# EasyEDA Pro project ProProject_AstrOnStep_2024-04-22.epro

# Schematic AstrOnStep SCH

## Sheets
1 Base: Create Date: 2024-03-13; Page Name: Base; Project Name: AstrOnStep; Schematic Name: AstrOnStep SCH; Update Date: 2024-04-21; Company: Velizy Astro Club; Drawed: Paul V.; Page Size: A4; Part Number: AstrOnStep-v1.0; Reviewed: Denis G.; Version: V1.0
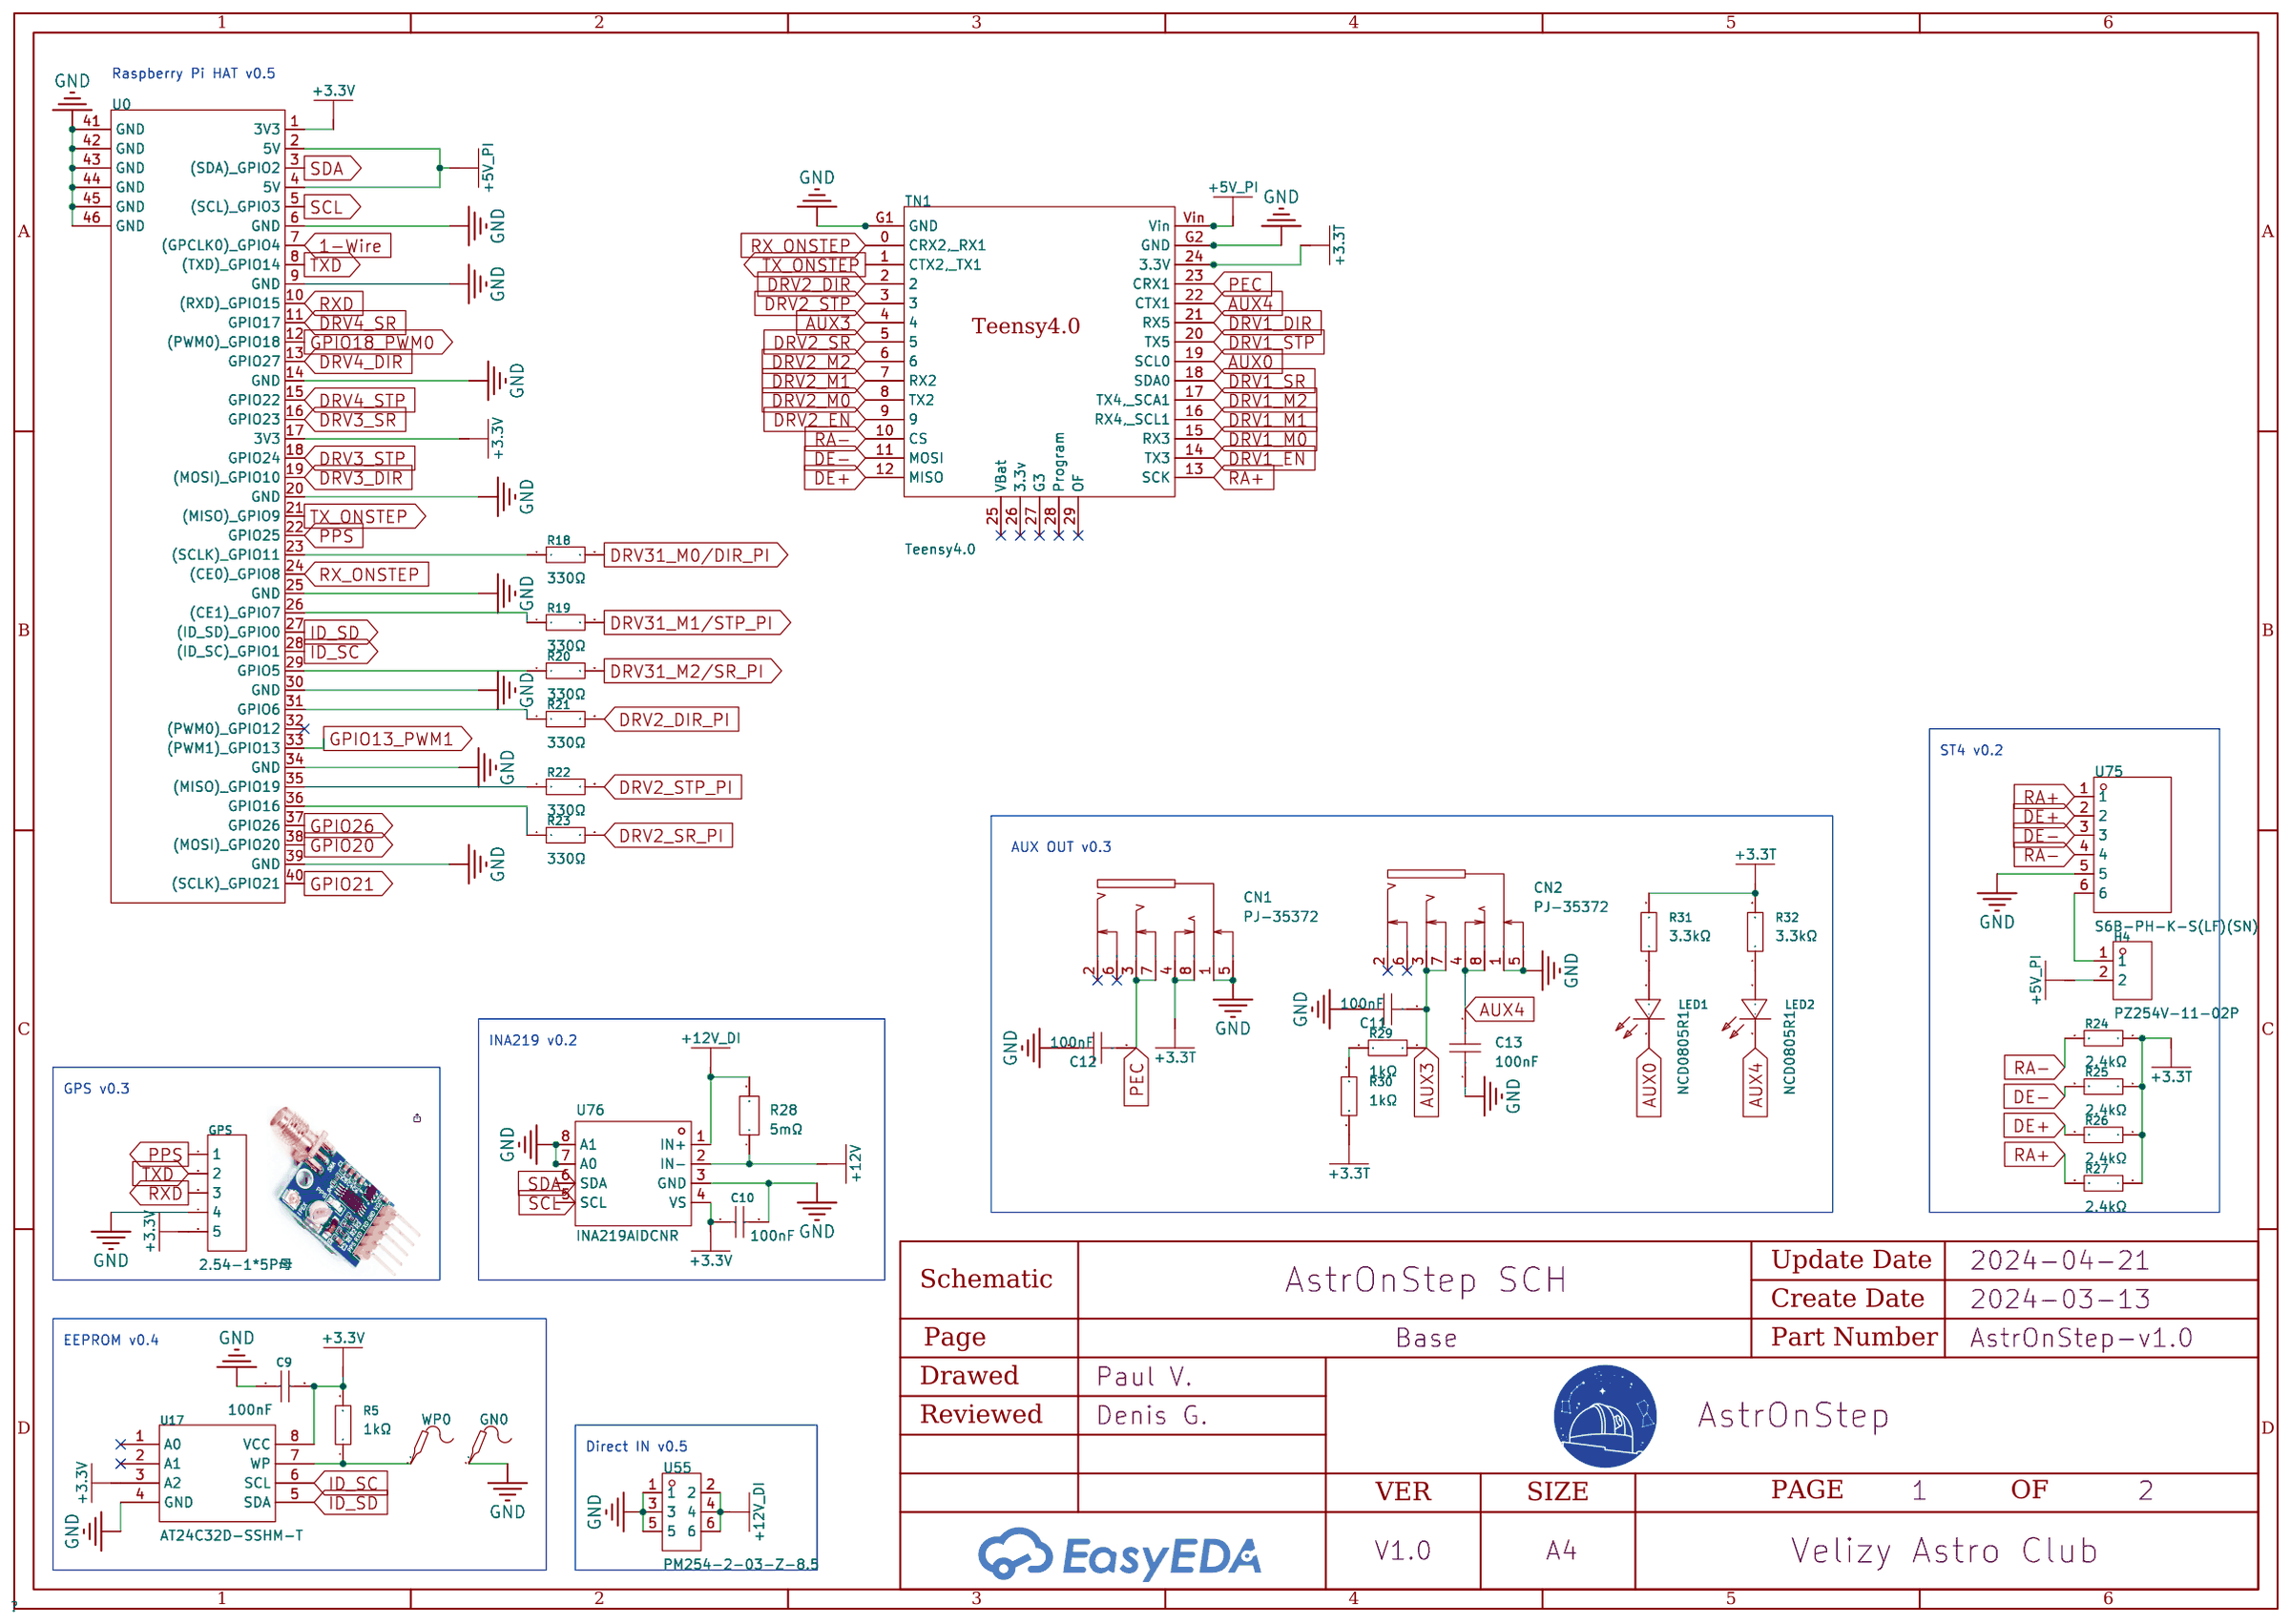
[diagram p0: Base]
2 Motors: Create Date: 2024-04-17; Page Name: Motors.AstrOnStep SCH; Update Date: 2024-04-19; Company: EasyEDA.com; Drawn: EasyEDA; Part Number: JLCPCB-002; Reviewed: EasyEDA; Version: V0.1
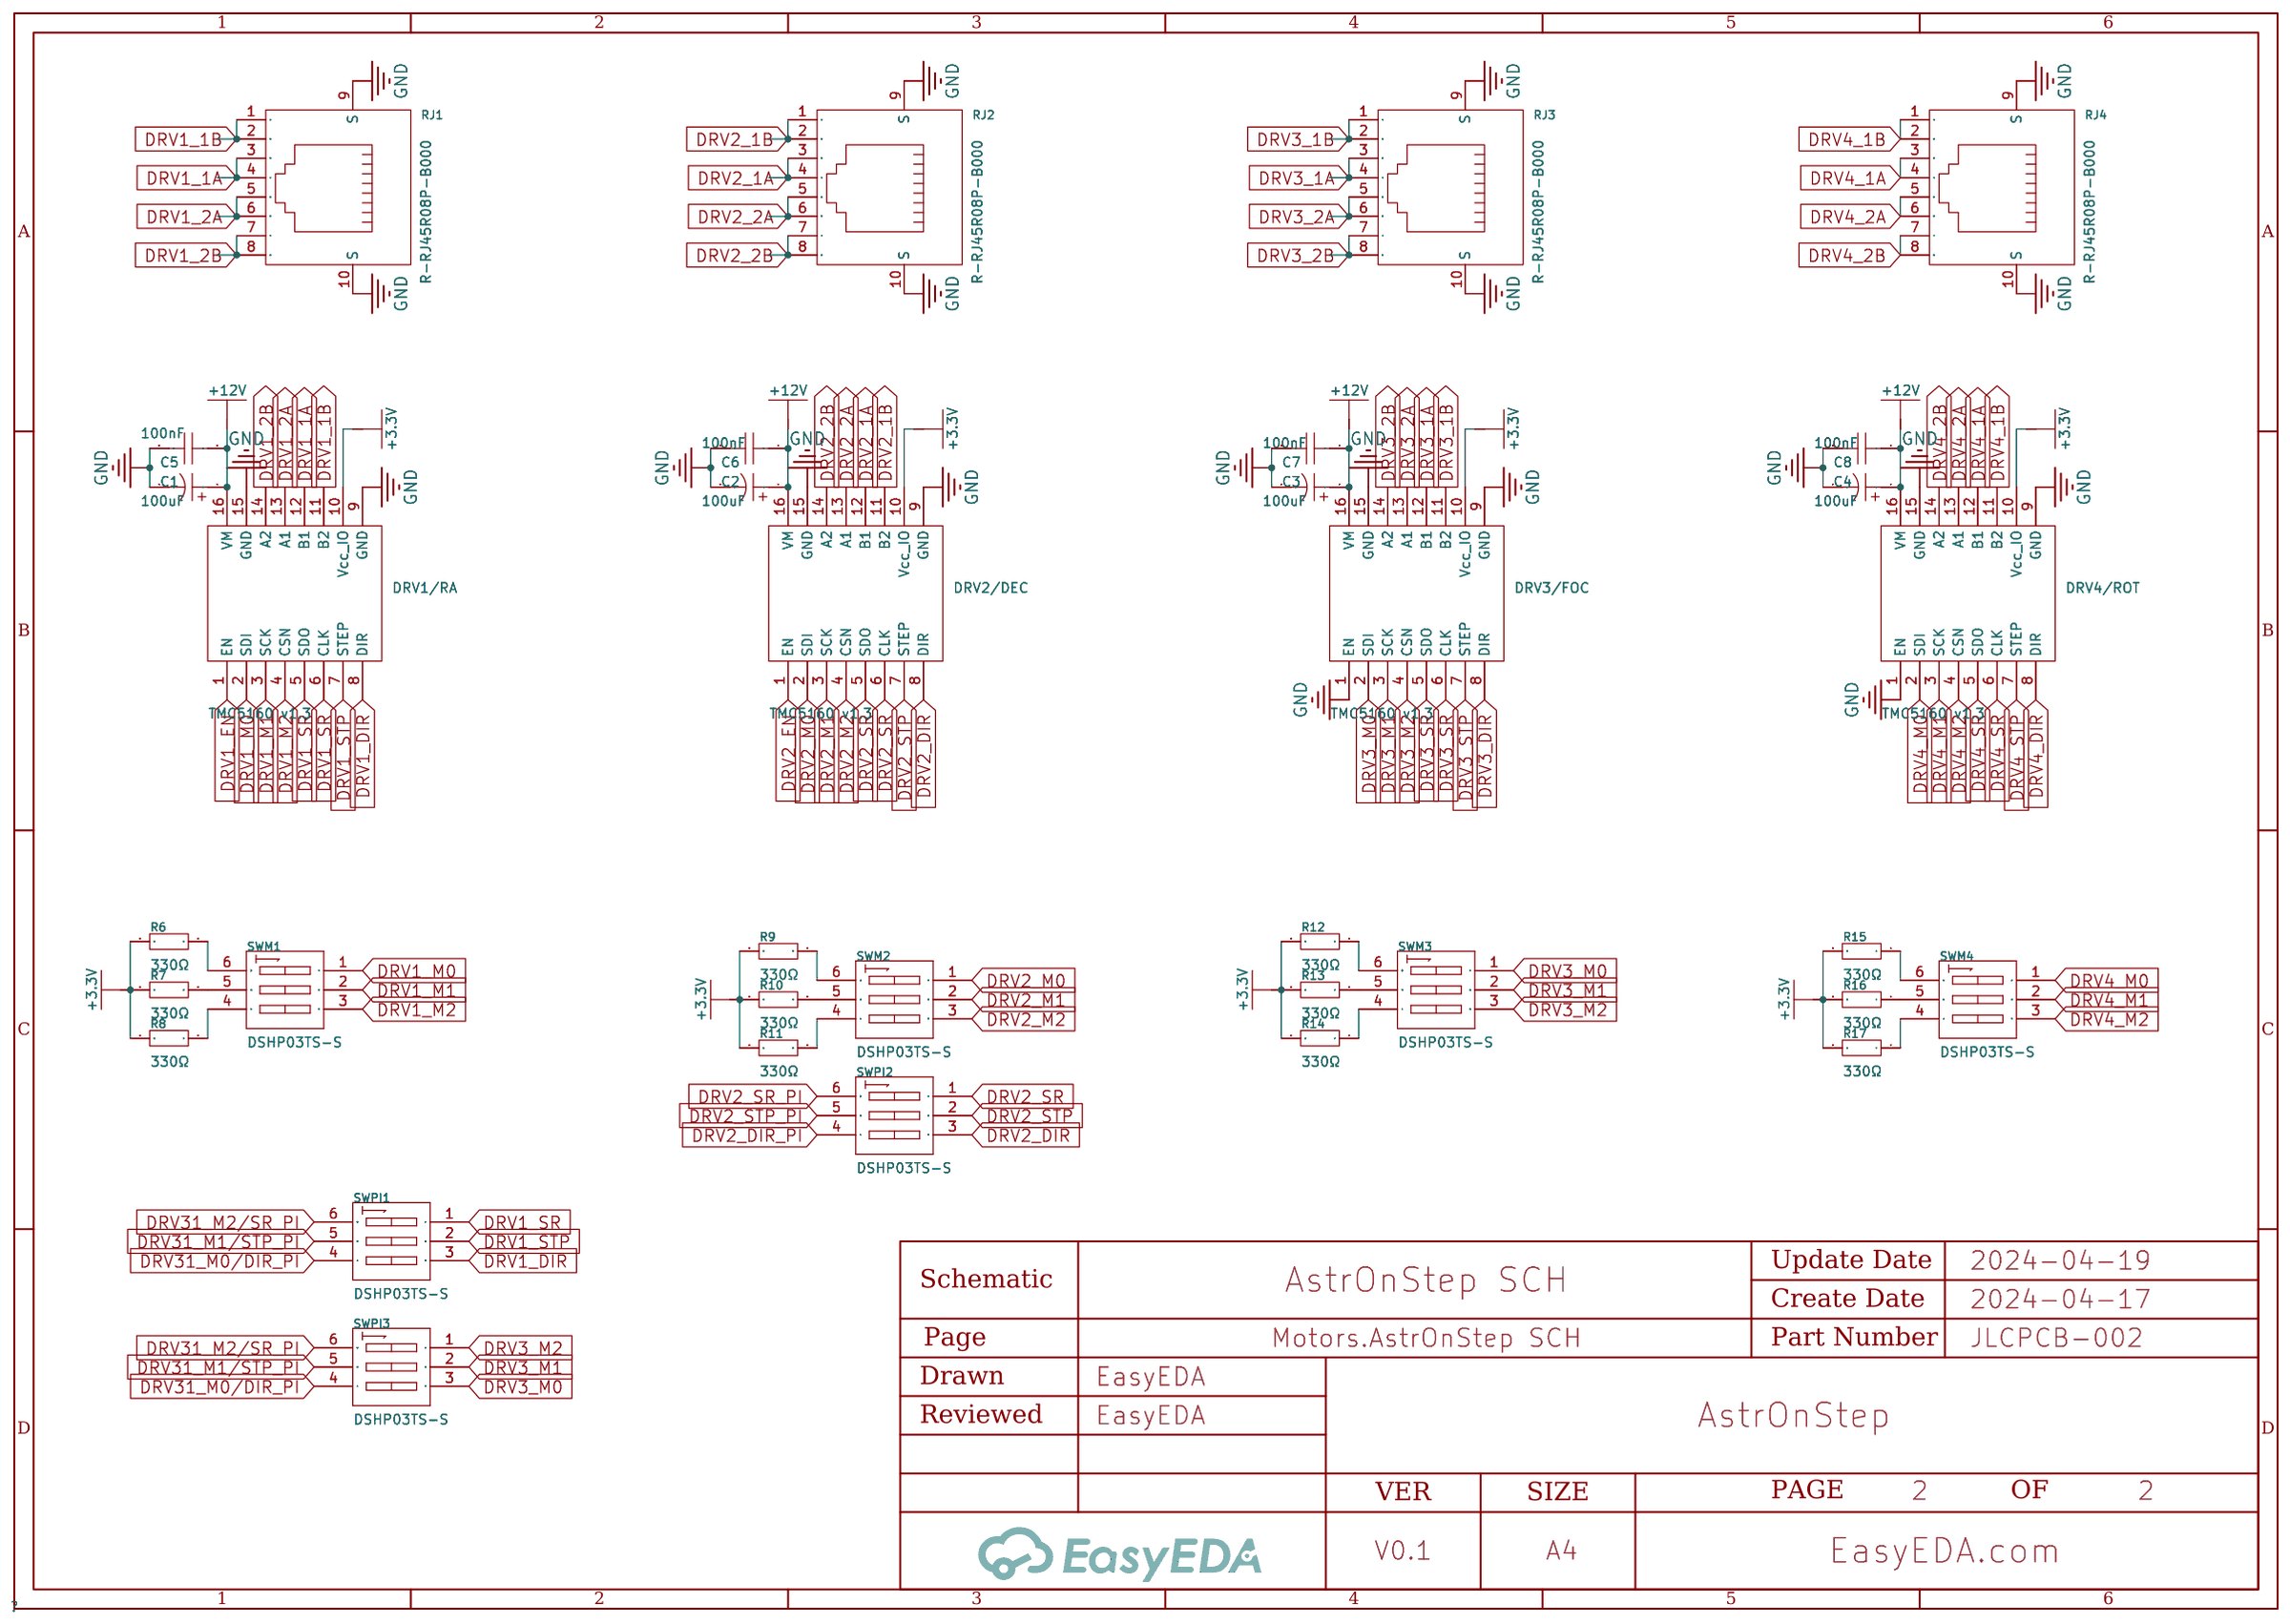
[diagram p1: Motors]

## Parts
sheet Base
C9  100nF  [C0402]
C10  100nF  [C0402]
C11  100nF  [C0603]
C12  100nF  [C0603]
C13  100nF  [C0603]
CN1  PJ-35372  [AUDIO-TH_PJ-35372]
CN2  PJ-35372  [AUDIO-TH_PJ-35372]
GN0  -  [Test-Point-0.5mm]
GPS  2.54-1*5P母  [HDR-TH_5P-P2.54-V-F]  (no BOM)
H4  PZ254V-11-02P  [HDR-TH_2P-P2.54-V-M]  (no BOM)
LED1  NCD0805R1  [LED0805-R-RD]
LED2  NCD0805R1  [LED0805-R-RD]
R5  1kΩ  [R0402]
R18  330Ω  [R0402]
R19  330Ω  [R0402]
R20  330Ω  [R0402]
R21  330Ω  [R0402]
R22  330Ω  [R0402]
R23  330Ω  [R0402]
R24  2.4kΩ  [R0603]
R25  2.4kΩ  [R0603]
R26  2.4kΩ  [R0603]
R27  2.4kΩ  [R0603]
R28  5mΩ  [R2512]
R29  1kΩ  [R0402]
R30  1kΩ  [R0402]
R31  3.3kΩ  [R0402]
R32  3.3kΩ  [R0402]
TN1  Teensy4.0  [TEENSY4.0]  (no BOM)
U0  RASPI HAT FULL  [RASBERRYPI-3-HAT-EXT]  (no BOM)
U17  AT24C32D-SSHM-T  [SOIC-8_L5.0-W4.0-P1.27-LS6.0-BL]
U55  PM254-2-03-Z-8.5  [HDR-TH_6P-P2.54-V-F-R2-C3-S2.54]  (no BOM)
U75  S6B-PH-K-S(LF)(SN)  [CONN-TH_6P-P2.00_S6B-PH-K-S-LF-SN]
U76  INA219AIDCNR  [SOT-23-8_L3.0-W1.7-P0.65-LS2.8-BR]
WP0  -  [Test-Point-0.5mm]
sheet Motors
C1  100uF  [CAP-SMD_BD6.3-L6.6-W6.6-LS7.3-FD]
C2  100uF  [CAP-SMD_BD6.3-L6.6-W6.6-LS7.3-FD]
C3  100uF  [CAP-SMD_BD6.3-L6.6-W6.6-LS7.3-FD]
C4  100uF  [CAP-SMD_BD6.3-L6.6-W6.6-LS7.3-FD]
C5  100nF  [C0603]
C6  100nF  [C0603]
C7  100nF  [C0603]
C8  100nF  [C0603]
DRV1/RA  TMC5160 v1.3  [TMC5160]  (no BOM)
DRV2/DEC  TMC5160 v1.3  [TMC5160]  (no BOM)
DRV3/FOC  TMC5160 v1.3  [TMC5160]  (no BOM)
DRV4/ROT  TMC5160 v1.3  [TMC5160]  (no BOM)
R6  330Ω  [R0402]
R7  330Ω  [R0402]
R8  330Ω  [R0402]
R9  330Ω  [R0402]
R10  330Ω  [R0402]
R11  330Ω  [R0402]
R12  330Ω  [R0402]
R13  330Ω  [R0402]
R14  330Ω  [R0402]
R15  330Ω  [R0402]
R16  330Ω  [R0402]
R17  330Ω  [R0402]
RJ1  R-RJ45R08P-B000  [RJ45-TH_R-RJ45R08P-B000]
RJ2  R-RJ45R08P-B000  [RJ45-TH_R-RJ45R08P-B000]
RJ3  R-RJ45R08P-B000  [RJ45-TH_R-RJ45R08P-B000]
RJ4  R-RJ45R08P-B000  [RJ45-TH_R-RJ45R08P-B000]
SWM1  DSHP03TS-S  [SW-SMD_DSHP03TS-S]
SWM2  DSHP03TS-S  [SW-SMD_DSHP03TS-S]
SWM3  DSHP03TS-S  [SW-SMD_DSHP03TS-S]
SWM4  DSHP03TS-S  [SW-SMD_DSHP03TS-S]
SWPI1  DSHP03TS-S  [SW-SMD_DSHP03TS-S]
SWPI2  DSHP03TS-S  [SW-SMD_DSHP03TS-S]
SWPI3  DSHP03TS-S  [SW-SMD_DSHP03TS-S]

## Library data of the parts
C9 C10 = CL05B104KO5NNNC: Capacitance: Tolerance:±10% Tolerance:±10% Voltage Rated: Temperature Coefficient:; LCSC Part Name: 100nF ±10% 16V; Supplier Part: C1525; Manufacturer: SAMSUNG(三星); Supplier Footprint: 0402; Datasheet: https://atta.szlcsc.com/upload/public/pdf/source/20160218/1457707763339.pdf; Supplier: LCSC; Tolerance: ±10%
C5-C8 C11-C13 = CC0603KRX7R9BB104: Capacitance:Tolerance:±10%Tolerance:±10%VoltageRated:TemperatureCoefficient:; LCSC Part Name: 100nF±10%50V; Supplier Part: C14663; Manufacturer: YAGEO(国巨); Supplier Footprint: 0603; JLCPCB Part Class: BasicPart; Datasheet: https://atta.szlcsc.com/upload/public/pdf/source/20180910/C282072_33301C7F631E79921B82A8DAC6BCC5B3.pdf; Supplier: LCSC; Tolerance: ±10%
CN1 CN2 = PJ-35372: Connector Type:3.5mm耳机座 Current Rating (Max):0.5A Voltage Rating (Max):30V Operating Temperature Range:-20℃~+70℃ Operating Temperature Range:-20℃~+70℃ Welding Temperature (Max):235℃; LCSC Part Name: 3.5mm耳机座 镀金4节; Supplier Part: C397354; Manufacturer: XKB Connectivity(中国星坤); Supplier Footprint: 插件; JLCPCB Part Class: Extended Part; Datasheet: https://atta.szlcsc.com/upload/public/pdf/source/20211011/70AECB394666925CFEDAEC6F68531937.pdf; Supplier: LCSC; Connector Type: 3.5mm耳机座; Current Rating (Max): 0.5A; Voltage Rating (Max): 30V; Operating Temperature Range: -20℃~+70℃; Welding Temperature (Max): 235℃
GN0 WP0 = Test-Point: Test Point 测试点
GPS = 2.54-1*5P母: Number of Rows:Plugin Number of Holes:5P Pitch:2.54mm Holes Structure:1x5P Row Spacing:- Mounting Type:Straight Insulation Height:- Contact Material:- Contact Plating:-; LCSC Part Name: 间距:2.54mm 1x5P 直插; Supplier Part: C50950; Manufacturer: BOOMELE(博穆精密); Supplier Footprint: 插件,P=2.54mm; Datasheet: https://atta.szlcsc.com/upload/public/pdf/source/20210301/C2718488_F4427B881E42CAA8DDB0B1C12B3A522C.pdf; Supplier: LCSC; Number of Rows: Plugin; Number of Holes: 5P; Pitch: 2.54mm; Holes Structure: 1x5P; Mounting Type: Straight
H4 = PZ254V-11-02P: Number of Rows:Plugin Number of Pins:2P Pitch:2.54mm Pin Structure:1x2P Row Spacing:- Mounting Type:Straight Circluar Pins/Square Pins:Square Pins Current Rating (Max):- Voltage Rating (Max):- Length of Mating Pin:6mm Insulation Height:2.5mm Length of End; LCSC Part Name: 2.54mm 1x2P 直插 方针; Supplier Part: C492401; Manufacturer: XFCN(兴飞); Supplier Footprint: 插件,P=2.54mm; JLCPCB Part Class: Extended Part; Datasheet: https://atta.szlcsc.com/upload/public/pdf/source/20200309/C492401_A812433581A9B211A7FFA413ADDFF0E5.pdf; Supplier: LCSC; Number of Rows: Plugin; Number of Pins: 2P; Pitch: 2.54mm; Pin Structure: 1x2P; Mounting Type: Straight; Circluar Pins/Square Pins: Square Pins; Length of Mating Pin: 6mm; Insulation Height: 2.5mm; Length of End Connection Pin: 3mm; Operating Temperature Range: -40℃~+105℃; Color: Black
LED1 LED2 = NCD0805R1_C84256: Emitted Color:Red Diode Configuration:- Lamp Holder Type:- Forward Voltage (VF):1.6V~2.6V Forward Voltage (VF):1.6V~2.6V Forward Current:20mA Power Dissipation:65mW Lens Color:无色透明 Dominant Wavelength:615nm~630nm Dominant Wavelength:615nm~630nm Peak Wavel; LCSC Part Name: 红灯 0805红灯   正贴; Supplier Part: C84256; Manufacturer: 国星光电; Supplier Footprint: 0805; JLCPCB Part Class: Basic Part; Datasheet: https://atta.szlcsc.com/upload/public/pdf/source/20200820/C84256_F0A75A43B3EAD75808600A0514C76B99.pdf; Supplier: LCSC; Emitted Color: Red; Forward Voltage (VF): 1.6V~2.6V; Forward Current: 20mA; Power Dissipation: 65mW; Lens Color: 无色透明; Dominant Wavelength: 615nm~630nm; Luminous Intensity: 67mcd~195mcd; Viewing Angle: 130°; Operating Temperature: -30℃~+85℃
R5 R29 R30 = 0402WGF1001TCE: Resistance:1000Ω Tolerance:±1% Tolerance:±1% Power(Watts): Overload Voltage (Max): Temperature Coefficient:±100ppm/℃ Temperature Coefficient:±100ppm/℃ Type:Thick Film Resistors Operating Temperature Range:-55℃~+155℃ Operating Temperature Range:-55℃~+155℃; LCSC Part Name: 1kΩ ±1% 62.5mW 厚膜电阻; Supplier Part: C11702; Manufacturer: UNI-ROYAL(厚声); Supplier Footprint: 0402; JLCPCB Part Class: Basic Part; Datasheet: https://atta.szlcsc.com/upload/public/pdf/source/20200306/C422600_1E6D84923E4A46A82E41ADD87F860B5C.pdf; Supplier: LCSC; Tolerance: ±1%; Temperature Coefficient: ±100ppm/℃; Type: Thick Film Resistors; Operating Temperature Range: -55℃~+155℃
R6-R23 = 0402WGF3300TCE: Type:Thick Film Resistors Resistance: Tolerance:±1% Tolerance:±1% Power(Watts): Overload Voltage (Max): Temperature Coefficient:±100ppm/℃ Temperature Coefficient:±100ppm/℃ Operating Temperature Range:-55℃~+155℃ Operating Temperature Range:-55℃~+155℃; LCSC Part Name: 330Ω ±1% 62.5mW 厚膜电阻; Supplier Part: C25104; Manufacturer: UNI-ROYAL(厚声); Supplier Footprint: 0402; Datasheet: https://atta.szlcsc.com/upload/public/pdf/source/20200306/C422600_1E6D84923E4A46A82E41ADD87F860B5C.pdf; Supplier: LCSC; Type: Thick Film Resistors; Tolerance: ±1%; Temperature Coefficient: ±100ppm/℃; Operating Temperature Range: -55℃~+155℃
R24-R27 = 0603WAF2401T5E: Type:Thick Film Resistors Resistance:2.4kΩ Tolerance:±1% Tolerance:±1% Power(Watts): Overload Voltage (Max): Temperature Coefficient:±100ppm/℃ Temperature Coefficient:±100ppm/℃ Operating Temperature Range:-55℃~+155℃ Operating Temperature Range:-55℃~+155℃; LCSC Part Name: 2.4kΩ ±1% 100mW 厚膜电阻; Supplier Part: C22940; Manufacturer: UNI-ROYAL(厚声); Supplier Footprint: 0603; Datasheet: https://atta.szlcsc.com/upload/public/pdf/source/20200306/C422600_1E6D84923E4A46A82E41ADD87F860B5C.pdf; Supplier: LCSC; Type: Thick Film Resistors; Tolerance: ±1%; Temperature Coefficient: ±100ppm/℃; Operating Temperature Range: -55℃~+155℃
R28 = PA2512FKF7T0R005E: Type: Resistance: Tolerance:±1% Tolerance:±1% Power(Watts): Temperature Coefficient:±100ppm/℃ Temperature Coefficient:±100ppm/℃ Operating Temperature Range:-55℃~+170℃ Operating Temperature Range:-55℃~+170℃; LCSC Part Name: 5mΩ ±1% 3W; Supplier Part: C728323; Manufacturer: YAGEO(国巨); Supplier Footprint: 2512; Datasheet: https://atta.szlcsc.com/upload/public/pdf/source/20200824/C728323_8414E4B9EE47C66850A19F4536DCF70D.pdf; Supplier: LCSC; Tolerance: ±1%; Temperature Coefficient: ±100ppm/℃; Operating Temperature Range: -55℃~+170℃
R31 R32 = 0402WGF3301TCE: Type:Thick Film Resistors Resistance:3.3kΩ Tolerance:±1% Tolerance:±1% Power(Watts): Overload Voltage (Max): Temperature Coefficient:±100ppm/℃ Temperature Coefficient:±100ppm/℃ Operating Temperature Range:-55℃~+155℃ Operating Temperature Range:-55℃~+155℃; LCSC Part Name: 3.3kΩ ±1% 62.5mW 厚膜电阻; Supplier Part: C25890; Manufacturer: UNI-ROYAL(厚声); Supplier Footprint: 0402; JLCPCB Part Class: Basic Part; Datasheet: https://atta.szlcsc.com/upload/public/pdf/source/20200306/C422600_1E6D84923E4A46A82E41ADD87F860B5C.pdf; Supplier: LCSC; Type: Thick Film Resistors; Tolerance: ±1%; Temperature Coefficient: ±100ppm/℃; Operating Temperature Range: -55℃~+155℃
TN1 = Teensy4.0
U0 = RASPI HAT FULL - NO OUTLINE: Manufacturer Part: RaspberryPi 3
U17 = AT24C32D-SSHM-T: Interface Type:I2C Memory Size:32Kbit Supply Voltage:1.7V~5.5V Supply Voltage:1.7V~5.5V Operating Temperature:-40℃~+85℃ Operating Temperature:-40℃~+85℃; Supplier Part: C60583; Manufacturer: MICROCHIP(美国微芯); Supplier Footprint: SOIC-8; Datasheet: https://atta.szlcsc.com/upload/public/pdf/source/20151012/1457707446205.pdf; Supplier: LCSC; Interface Type: I2C; Memory Size: 32Kbit; Supply Voltage: 1.7V~5.5V; Operating Temperature: -40℃~+85℃
U55 = PM254-2-03-Z-8.5: Holes Structure:2x3P Pitch:2.54mm Row Spacing:2.54mm Circular Hole / Square Hole:Square Holes Mounting Type:Straight Number of Rows:双排 Number of Holes:6P Current Rating (Max):3A Voltage Rating (Max):- Holes Direction:Top Insulation Height:8.5mm Contact Ma; LCSC Part Name: 2x3P 间距:2.54mm 直插; Supplier Part: C2897404; Manufacturer: HCTL(华灿天禄); Supplier Footprint: 插件,P=2.54mm; Datasheet: https://atta.szlcsc.com/upload/public/pdf/source/20230609/3D36CA2C1BFC9FD1C3F709AD9DFEB9C2.pdf; Supplier: LCSC; Holes Structure: 2x3P; Pitch: 2.54mm; Row Spacing: 2.54mm; Circular Hole / Square Hole: Square Holes; Mounting Type: Straight; Number of Rows: 双排; Number of Holes: 6P; Current Rating (Max): 3A; Holes Direction: Top; Insulation Height: 8.5mm; Contact Material: Copper Alloy; Operating Temperature Range: -40℃~+105℃; Soldering Temperature(Max): 260℃@5S
U75 = S6B-PH-K-S(LF)(SN): Pins Structure:1x6P Pitch:2mm Mounting Style:Right-Angle Reference Series:PH Number of Pins:6P Number of Rows:1 Number of PINs Per Row:6 Row Spacing:- Contact Material:Brass; LCSC Part Name: 系列:PH 间距:2mm 1x6P; Supplier Part: C157920; Manufacturer: JST; Supplier Footprint: 弯插,P=2mm; JLCPCB Part Class: Extended Part; Datasheet: https://atta.szlcsc.com/upload/public/pdf/source/20181010/C265101_22107ACC4D8714694FDA2DD97145FA81.pdf; Supplier: LCSC; Pins Structure: 1x6P; Pitch: 2mm; Mounting Style: Right-Angle; Reference Series: PH; Number of Pins: 6P; Number of Rows: 1; Number of PINs Per Row: 6; Contact Material: Brass
U76 = INA219AIDCNR: Supplier Part: C87469; Manufacturer: TI(德州仪器); Supplier Footprint: SOT-23-8; JLCPCB Part Class: Extended Part; Datasheet: https://www.ti.com/cn/lit/gpn/ina219; Supplier: LCSC
C1-C4 = RST100UF25V004: Capacitance: Tolerance:±20% Tolerance:±20% Rated Voltage: Ripple Current:88mA@120Hz Equivalent Series Resistance(ESR):- φD: L: Lifetime @ Temp:2000hrs@105℃ Operating Temperature:-40℃~+105℃ Operating Temperature:-40℃~+105℃; LCSC Part Name: 100uF ±20% 25V; Supplier Part: C4747964; Manufacturer: KNSCHA(科尼盛); Supplier Footprint: SMD,D6.3xL5.4mm; Datasheet: https://atta.szlcsc.com/upload/public/pdf/source/20220722/52F6C209ACF875FF59C64C72CE2329EE.pdf; Supplier: LCSC; Tolerance: ±20%; Ripple Current: 88mA@120Hz; Lifetime @ Temp: 2000hrs@105℃; Operating Temperature: -40℃~+105℃
DRV1/RA DRV2/DEC DRV3/FOC DRV4/ROT = TMC5160 v1.3: Manufacturer: Bigtreetech; Supplier: TRIMAC
RJ1-RJ4 = R-RJ45R08P-B000: Connector Type:RJReceptacle USOC Codes:RJ45 Number of Ports:1 Mounting Style:Right-Angle Shielding:有屏蔽 LED:不带LED Ratings:- Operating Temperature Range:0℃~+70℃ Operating Temperature Range:0℃~+70℃; LCSC Part Name: RJ45 弯插 不带LED; Supplier Part: C386756; Manufacturer: Ckmtw(灿科盟); Supplier Footprint: 插件; Datasheet: https://atta.szlcsc.com/upload/public/pdf/source/20190508/C386756_CEA064C28A6A9ED64075DA45BB64214F.pdf; Supplier: LCSC; Connector Type: RJReceptacle; USOC Codes: RJ45; Number of Ports: 1; Mounting Style: Right-Angle; Shielding: 有屏蔽; LED: 不带LED; Operating Temperature Range: 0℃~+70℃
SWM1-SWM4 SWPI1-SWPI3 = DSHP03TS-S: Type:平拨,凹槽式 Circuit:SPST Number of Positions:3Bit Pin Style:Gull Wing Lead Pitch:1.27mm Current Rating:25mA Voltage Rating:24V Operating Temperature:-20℃~+70℃ Operating Temperature:-20℃~+70℃ Operating Life:3千次 Color:Black; LCSC Part Name: 间距1.27mm 平拨,凹槽式 3位拨码开关; Supplier Part: C319051; Manufacturer: XKB Connectivity(中国星坤); Supplier Footprint: SMD-6P,5.4x5.4mm; Datasheet: https://atta.szlcsc.com/upload/public/pdf/source/20211009/11BE85C99D2C85B0991AF4F9D6EB8BDE.pdf; Supplier: LCSC; Type: 平拨,凹槽式; Circuit: SPST; Number of Positions: 3Bit; Pin Style: Gull Wing; Lead Pitch: 1.27mm; Current Rating: 25mA; Voltage Rating: 24V; Operating Temperature: -20℃~+70℃; Operating Life: 3千次; Color: Black

## Nets
+3.3V: C9.2 C10.1 DRV1/RA.10(Vcc IO) DRV2/DEC.10(Vcc IO) DRV3/FOC.10(Vcc IO) DRV4/ROT.10(Vcc IO) GPS.5 R5.2 R6.2 R7.2 R8.2 R9.2 R10.2 R11.2 R12.2 R13.2 R14.2 R15.2 R16.2 R17.2 U0.1(3V3) U0.17(3V3) U17.3(A2) U17.8(VCC) U76.4(VS)
+5V_PI: H4.2 TN1.Vin U0.2(5V) U0.4(5V)
+12V: C1.1 C2.1 C3.1 C4.1 C5.1 C6.1 C7.1 C8.1 DRV1/RA.16(VM) DRV2/DEC.16(VM) DRV3/FOC.16(VM) DRV4/ROT.16(VM) R28.1 U76.2(IN-)
+12V_DI: R28.2 U55.2 U55.4 U55.6 U76.1(IN+)
GND: C1.2 C2.2 C3.2 C4.2 C5.2 C6.2 C7.2 C8.2 C9.1 C10.2 C11.2 C12.2 C13.1 CN1.1 CN1.5 CN2.1 CN2.5 DRV1/RA.9(GND) DRV1/RA.15(GND) DRV2/DEC.9(GND) DRV2/DEC.15(GND) DRV3/FOC.1(EN) DRV3/FOC.9(GND) DRV3/FOC.15(GND) DRV4/ROT.1(EN) DRV4/ROT.9(GND) DRV4/ROT.15(GND) GN0.1 GPS.4 RJ1.9(S) RJ1.10(S) RJ2.9(S) RJ2.10(S) RJ3.9(S) RJ3.10(S) RJ4.9(S) RJ4.10(S) TN1.G1(GND) TN1.G2(GND) U0.6(GND) U0.9(GND) U0.14(GND) U0.20(GND) U0.25(GND) U0.30(GND) U0.34(GND) U0.39(GND) U0.41(GND) U0.42(GND) U0.43(GND) U0.44(GND) U0.45(GND) U0.46(GND) U17.4(GND) U55.1 U55.3 U55.5 U75.5 U76.3(GND) U76.7(A0) U76.8(A1)
1-Wire: U0.7((GPCLK0) GPIO4)
+3.3T: CN1.4 CN1.8 R24.1 R25.1 R26.1 R27.1 R30.1 R31.2 R32.2 TN1.24(3.3V)
AUX0: LED1.2(-) TN1.19(SCL0)
AUX3: C11.1 CN2.3 CN2.7 R29.1 TN1.4
AUX4: C13.2 CN2.4 CN2.8 LED2.2(-) TN1.22(CTX1)
DE+: R26.2 TN1.12(MISO) U75.2
DE-: R25.2 TN1.11(MOSI) U75.3
DRV1_1A: DRV1/RA.12(B1) RJ1.3 RJ1.4
DRV1_1B: DRV1/RA.11(B2) RJ1.1 RJ1.2
DRV1_2A: DRV1/RA.13(A1) RJ1.5 RJ1.6
DRV1_2B: DRV1/RA.14(A2) RJ1.7 RJ1.8
DRV1_DIR: DRV1/RA.8(DIR) SWPI1.3 TN1.21(RX5)
DRV1_EN: DRV1/RA.1(EN) TN1.14(TX3)
DRV1_M0: DRV1/RA.2(SDI) SWM1.1 TN1.15(RX3)
DRV1_M1: DRV1/RA.3(SCK) SWM1.2 TN1.16(RX4, SCL1)
DRV1_M2: DRV1/RA.4(CSN) SWM1.3 TN1.17(TX4, SCA1)
DRV1_SR: DRV1/RA.5(SDO) DRV1/RA.6(CLK) SWPI1.1 TN1.18(SDA0)
DRV1_STP: DRV1/RA.7(STEP) SWPI1.2 TN1.20(TX5)
DRV2_1A: DRV2/DEC.12(B1) RJ2.3 RJ2.4
DRV2_1B: DRV2/DEC.11(B2) RJ2.1 RJ2.2
DRV2_2A: DRV2/DEC.13(A1) RJ2.5 RJ2.6
DRV2_2B: DRV2/DEC.14(A2) RJ2.7 RJ2.8
DRV2_DIR: DRV2/DEC.8(DIR) SWPI2.3 TN1.2
DRV2_DIR_PI: R21.2 SWPI2.4
DRV2_EN: DRV2/DEC.1(EN) TN1.9
DRV2_M0: DRV2/DEC.2(SDI) SWM2.1 TN1.8(TX2)
DRV2_M1: DRV2/DEC.3(SCK) SWM2.2 TN1.7(RX2)
DRV2_M2: DRV2/DEC.4(CSN) SWM2.3 TN1.6
DRV2_SR: DRV2/DEC.5(SDO) DRV2/DEC.6(CLK) SWPI2.1 TN1.5
DRV2_SR_PI: R23.2 SWPI2.6
DRV2_STP: DRV2/DEC.7(STEP) SWPI2.2 TN1.3
DRV2_STP_PI: R22.2 SWPI2.5
DRV3_1A: DRV3/FOC.12(B1) RJ3.3 RJ3.4
DRV3_1B: DRV3/FOC.11(B2) RJ3.1 RJ3.2
DRV3_2A: DRV3/FOC.13(A1) RJ3.5 RJ3.6
DRV3_2B: DRV3/FOC.14(A2) RJ3.7 RJ3.8
DRV3_DIR: DRV3/FOC.8(DIR) U0.19((MOSI) GPIO10)
DRV3_M0: DRV3/FOC.2(SDI) SWM3.1 SWPI3.3
DRV3_M1: DRV3/FOC.3(SCK) SWM3.2 SWPI3.2
DRV3_M2: DRV3/FOC.4(CSN) SWM3.3 SWPI3.1
DRV3_SR: DRV3/FOC.5(SDO) DRV3/FOC.6(CLK) U0.16(GPIO23)
DRV3_STP: DRV3/FOC.7(STEP) U0.18(GPIO24)
DRV4_1A: DRV4/ROT.12(B1) RJ4.3 RJ4.4
DRV4_1B: DRV4/ROT.11(B2) RJ4.1 RJ4.2
DRV4_2A: DRV4/ROT.13(A1) RJ4.5 RJ4.6
DRV4_2B: DRV4/ROT.14(A2) RJ4.7 RJ4.8
DRV4_DIR: DRV4/ROT.8(DIR) U0.13(GPIO27)
DRV4_M0: DRV4/ROT.2(SDI) SWM4.1
DRV4_M1: DRV4/ROT.3(SCK) SWM4.2
DRV4_M2: DRV4/ROT.4(CSN) SWM4.3
DRV4_SR: DRV4/ROT.5(SDO) DRV4/ROT.6(CLK) U0.11(GPIO17)
DRV4_STP: DRV4/ROT.7(STEP) U0.15(GPIO22)
DRV31_M0/DIR_PI: R18.2 SWPI1.4 SWPI3.4
DRV31_M1/STP_PI: R19.2 SWPI1.5 SWPI3.5
DRV31_M2/SR_PI: R20.2 SWPI1.6 SWPI3.6
GPIO13_PWM1: U0.33((PWM1) GPIO13)
GPIO18_PWM0: U0.12((PWM0) GPIO18)
GPIO20: U0.38((MOSI) GPIO20)
GPIO21: U0.40((SCLK) GPIO21)
GPIO26: U0.37(GPIO26)
ID_SC: U0.28((ID_SC) GPIO1) U17.6(SCL)
ID_SD: U0.27((ID_SD) GPIO0) U17.5(SDA)
PEC: C12.1 CN1.3 CN1.7 TN1.23(CRX1)
PPS: GPS.1 U0.22(GPIO25)
RA+: R27.2 TN1.13(SCK) U75.1
RA-: R24.2 TN1.10(CS) U75.4
RX_ONSTEP: TN1.0(CRX2, RX1) U0.24((CE0) GPIO8)
RXD: GPS.3 U0.10((RXD) GPIO15)
SCL: U0.5((SCL) GPIO3) U76.5(SCL)
SDA: U0.3((SDA) GPIO2) U76.6(SDA)
TX_ONSTEP: TN1.1(CTX2, TX1) U0.21((MISO) GPIO9)
TXD: GPS.2 U0.8((TXD) GPIO14)
$2N62787: R5.1 U17.7(WP) WP0.1
$2N104513: H4.1 U75.6
$2N105510: R18.1 U0.23((SCLK) GPIO11)
$2N105512: R19.1 U0.26((CE1) GPIO7)
$2N105514: R20.1 U0.29(GPIO5)
$2N105697: R21.1 U0.31(GPIO6)
$2N105699: R22.1 U0.35((MISO) GPIO19)
$2N105701: R23.1 U0.36(GPIO16)
$2N106392: LED1.1(+) R31.1
$2N106431: LED2.1(+) R32.1
$2N106601: R29.2 R30.2
$9N9567: R15.1 SWM4.6
$9N9568: R17.1 SWM4.4
$9N9569: R16.1 SWM4.5
$9N9693: R14.1 SWM3.4
$9N9694: R12.1 SWM3.6
$9N9695: R13.1 SWM3.5
$9N9819: R11.1 SWM2.4
$9N9820: R9.1 SWM2.6
$9N9821: R10.1 SWM2.5
$9N9945: R6.1 SWM1.6
$9N9946: R8.1 SWM1.4
$9N9947: R7.1 SWM1.5

Not connected (* = marked no-connect by the designer): CN1 2* 6*; CN2 2* 6*; TN1 25(VBat)* 26(3.3v)* 27(G3)* 28(Program)* 29(OF)*; U0 32((PWM0) GPIO12)*; U17 1(A0)* 2(A1)*

## Notes on the sheets
sheet 1
- Raspberry Pi HAT v0.5
- ST4 v0.2
- AUX OUT v0.3
- INA219 v0.2
- GPS v0.3
- EEPROM v0.4
- Direct IN v0.5

# Board AstrOnStep PCB
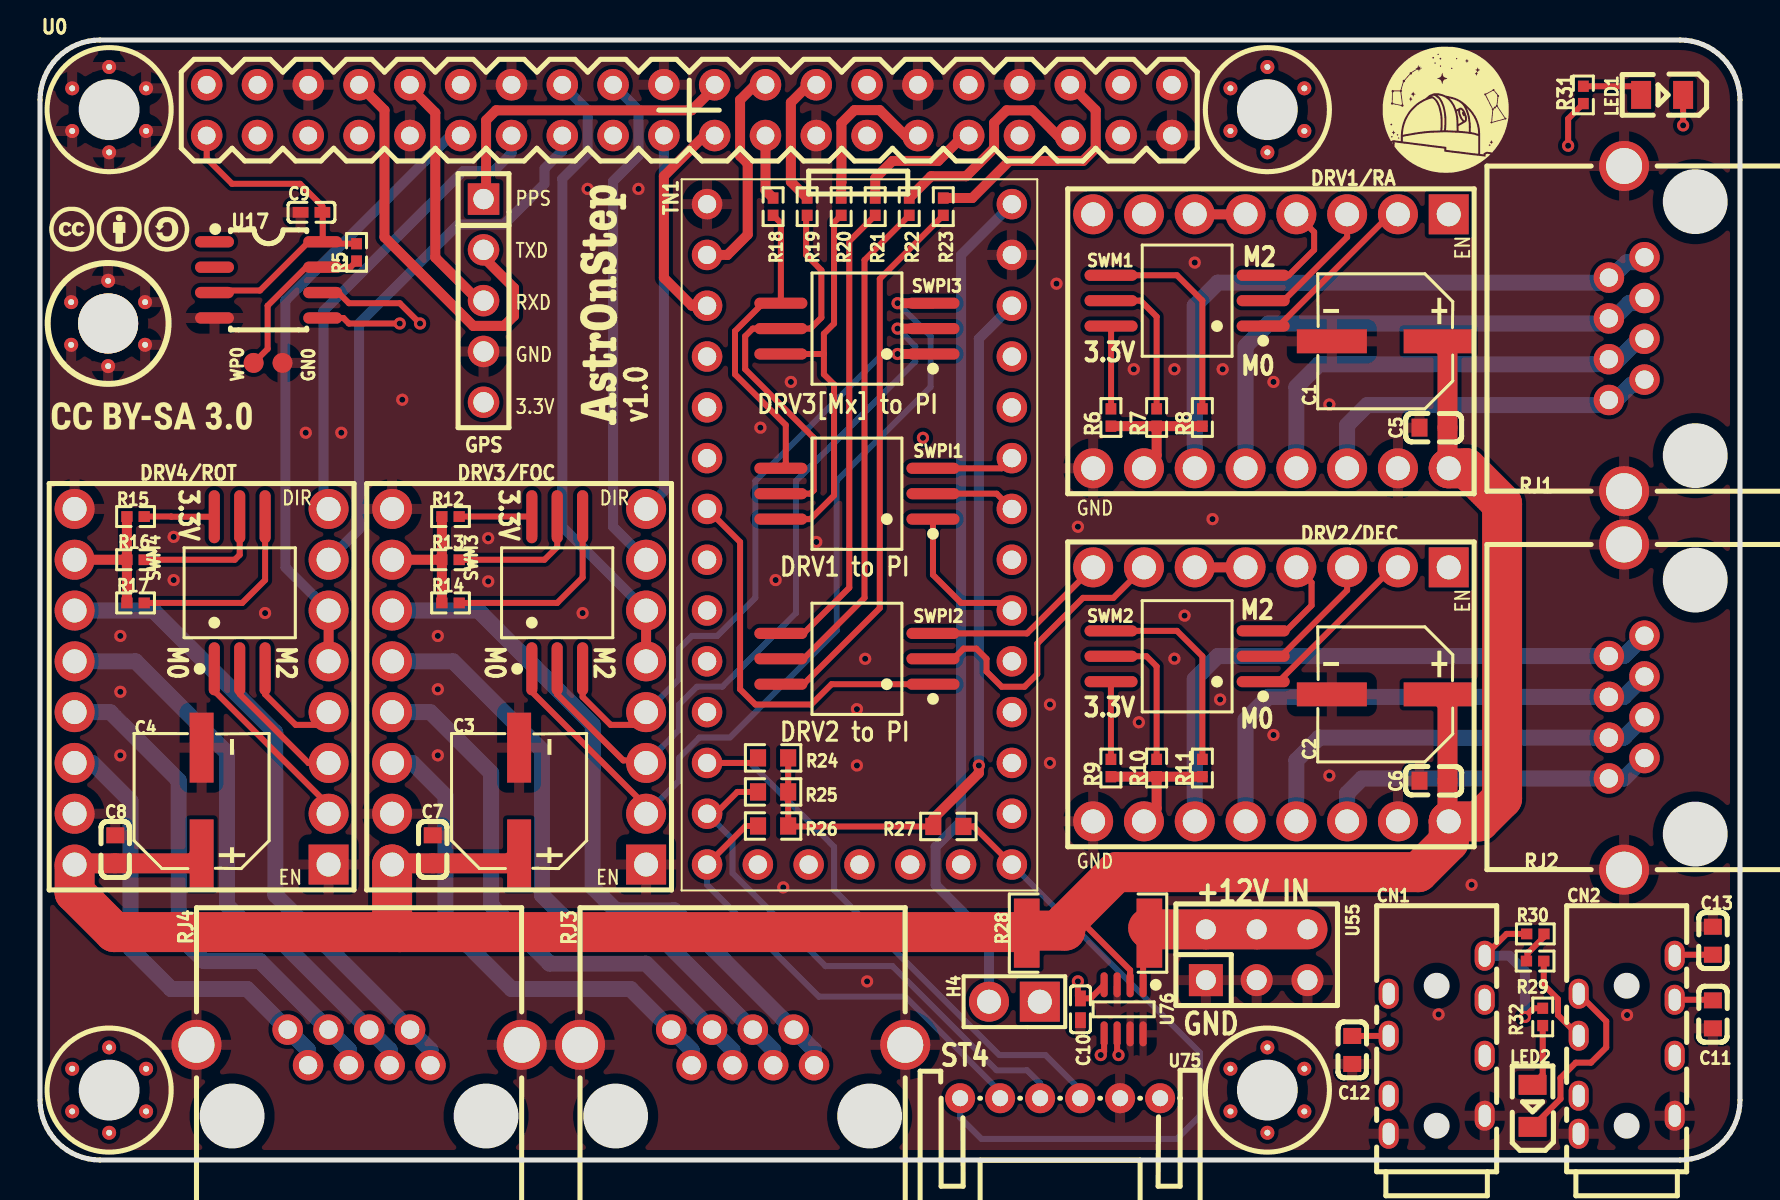
[diagram p2: board, top side]
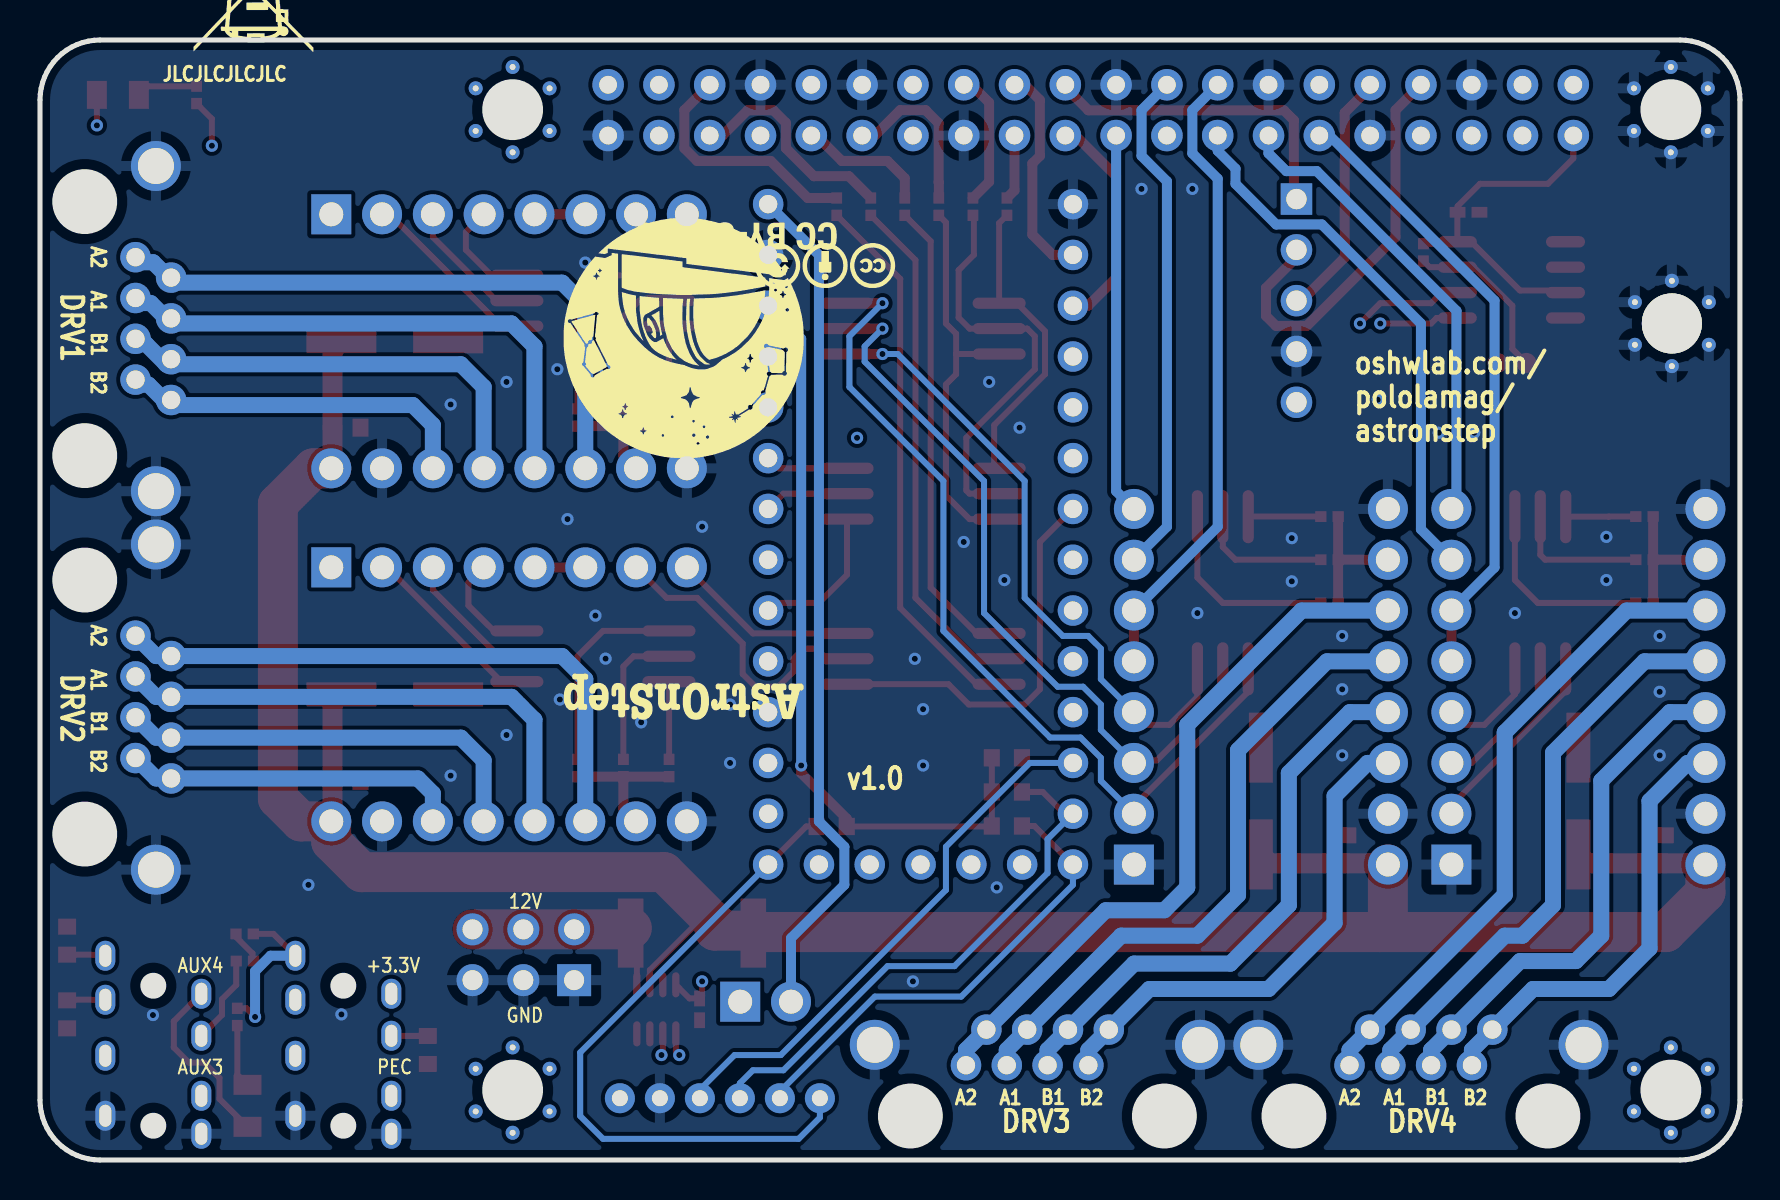
[diagram p3: board, bottom side, seen from below]

Outline 85 x 56 mm; copper layers: Top Layer, Inner1, Inner2, Inner3, Inner4, Inner5, Inner6, Inner7, Inner8, Inner9, Inner10, Inner11, Inner12, Inner13, Inner14, Inner15, Inner16, Inner17, Inner18, Inner19, Inner20, Inner21, Inner22, Inner23, Inner24, Inner25, Inner26, Inner27, Inner28, Inner29, Inner30, Bottom Layer. Coordinates in mm from the lower left corner of the outline.
Stack: Top Layer 0.035mm 外层铜厚1oz / Dielectric1 0.2104mm 7628 RC49% 8.6mil / Inner1 0.0152mm 内层铜厚 / Dielectric2 1.065mm 1.1mm H/HOZ 含铜 / Inner2 0.0152mm 内层铜厚 / Dielectric3 0.2104mm 7628 RC49% 8.6mil / Bottom Layer 0.035mm 外层铜厚1oz

## Design rules (mm)
template: Custom Config
spacing copperThickness1oz (default): track to track 0.102, other pairs 0.152 to 0.3
spacing copperThickness2oz: track to track 0.203, other pairs 0.152 to 0.3
track width copperThickness1oz (default): min 0.254, default 0.454, max 2.54
track width copperThickness2oz: min 0.203, default 0.454, max 2.54
differential pair differentialPair (default): width min 0.127, default 0.254, max 2.54; gap min 0.152, default 0.152
via viaSize (default): diameter min 0.5, default 0.61, max 10; hole min 0.3, default 0.305, max 6.3

## Placement (name value [footprint] x y rotation side)
C1  100uF  [CAP-SMD_BD6.3-L6.6-W6.6-LS7.3-FD]  67.26 40.94 180 top
C2  100uF  [CAP-SMD_BD6.3-L6.6-W6.6-LS7.3-FD]  67.26 23.28 180 top
C3  100uF  [CAP-SMD_BD6.3-L6.6-W6.6-LS7.3-FD]  23.95 17.95 90 top
C4  100uF  [CAP-SMD_BD6.3-L6.6-W6.6-LS7.3-FD]  8.08 17.95 90 top
C5  100nF  [C0603]  69.68 36.62 180 top
C6  100nF  [C0603]  69.68 18.96 180 top
C7  100nF  [C0603]  19.64 15.53 90 top
C8  100nF  [C0603]  3.76 15.53 90 top
C9  100nF  [C0402]  13.57 47.38 0 top
C10  100nF  [C0402]  52.02 7.53 270 top
C11  100nF  [C0603]  83.65 7.28 270 top
C12  100nF  [C0603]  65.61 5.5 270 top
C13  100nF  [C0603]  83.65 10.96 270 top
CN1  PJ-35372  [audio-th_pj-35372]  69.83 5.76 180 top
CN2  PJ-35372  [audio-th_pj-35372]  79.33 5.76 180 top
DRV1/RA  TMC5160 v1.3  [tmc5160]  70.44 47.28 270 top
DRV2/DEC  TMC5160 v1.3  [tmc5160]  70.44 29.63 270 top
DRV3/FOC  TMC5160 v1.3  [tmc5160]  30.31 14.77 180 top
DRV4/ROT  TMC5160 v1.3  [tmc5160]  14.43 14.77 180 top
GN0  -  [test-point-0.5mm]  12.13 39.85 90 top
GPS  2.54-1*5P母  [hdr-th_5p-p2.54-v-f]  22.18 42.97 270 top
H4  PZ254V-11-02P  [HDR-TH_2P-P2.54-V-M]  48.72 7.92 180 top
LED1  NCD0805R1  [LED0805-R-RD]  81.1 53.25 180 top
LED2  NCD0805R1  [LED0805-R-RD]  74.63 2.71 90 top
NOREF  -  [Pad_e117046]  3.41 39.69 0 top
NOREF#2  -  [Pad_e117045]  5.26 40.76 0 top
NOREF#3  -  [Pad_e117044]  5.26 42.89 0 top
NOREF#4  -  [Pad_e117048]  1.56 42.89 0 top
NOREF#5  -  [Pad_e117043]  3.41 43.96 0 top
NOREF#6  -  [Pad_e241]  3.41 41.83 180 top
NOREF#7  -  [Pad_e117047]  1.56 40.76 0 top
R5  1kΩ  [R0402]  15.83 45.38 90 top
R6  330Ω  [R0402]  53.55 37.12 270 top
R7  330Ω  [R0402]  55.83 37.12 270 top
R8  330Ω  [R0402]  58.12 37.12 270 top
R9  330Ω  [R0402]  53.55 19.6 270 top
R10  330Ω  [R0402]  55.83 19.6 270 top
R11  330Ω  [R0402]  58.12 19.6 270 top
R12  330Ω  [R0402]  20.53 32.17 180 top
R13  330Ω  [R0402]  20.53 30.01 180 top
R14  330Ω  [R0402]  20.53 27.85 180 top
R15  330Ω  [R0402]  4.78 32.17 180 top
R16  330Ω  [R0402]  4.78 30.01 180 top
R17  330Ω  [R0402]  4.78 27.85 180 top
R18  330Ω  [R0402]  36.66 47.67 270 top
R19  330Ω  [R0402]  38.36 47.67 270 top
R20  330Ω  [R0402]  40.06 47.67 270 top
R21  330Ω  [R0402]  41.76 47.67 270 top
R22  330Ω  [R0402]  43.46 47.67 270 top
R23  330Ω  [R0402]  45.16 47.67 270 top
R24  2.4kΩ  [R0603]  36.66 20.11 180 top
R25  2.4kΩ  [R0603]  36.66 18.4 180 top
R26  2.4kΩ  [R0603]  36.66 16.7 180 top
R27  2.4kΩ  [R0603]  45.42 16.68 0 top
R28  5mΩ  [R2512]  52.4 11.34 0 top
R29  1kΩ  [R0402]  74.75 9.95 180 top
R30  1kΩ  [R0402]  74.77 11.31 0 top
R31  3.3kΩ  [R0402]  77.17 53.25 270 top
R32  3.3kΩ  [R0402]  75.14 7.15 90 top
RJ1  R-RJ45R08P-B000  [rj45-th_r-rj45r08p-b000]  79.33 41.57 90 top
RJ2  R-RJ45R08P-B000  [rj45-th_r-rj45r08p-b000]  79.33 22.65 90 top
RJ3  R-RJ45R08P-B000  [rj45-th_r-rj45r08p-b000]  35.13 5.63 0 top
RJ4  R-RJ45R08P-B000  [rj45-th_r-rj45r08p-b000]  15.95 5.63 0 top
SWM1  DSHP03TS-S  [SW-SMD_DSHP03TS-S]  57.36 42.97 90 top
SWM2  DSHP03TS-S  [SW-SMD_DSHP03TS-S]  57.36 25.19 90 top
SWM3  DSHP03TS-S  [SW-SMD_DSHP03TS-S]  25.86 28.36 0 top
SWM4  DSHP03TS-S  [SW-SMD_DSHP03TS-S]  9.98 28.36 0 top
SWPI1  DSHP03TS-S  [SW-SMD_DSHP03TS-S]  40.85 33.31 90 top
SWPI2  DSHP03TS-S  [SW-SMD_DSHP03TS-S]  40.85 25.06 90 top
SWPI3  DSHP03TS-S  [SW-SMD_DSHP03TS-S]  40.85 41.57 90 top
TN1  Teensy4.0  [teensy4.0]  33.35 47.79 0 top
U0  RASPI HAT FULL  [RASBERRYPI-3-HAT-EXT]  8.33 53.76 0 top
U17  AT24C32D-SSHM-T  [SOIC-8_L5.0-W4.0-P1.27-LS6.0-BL]  11.43 44.01 270 top
U55  PM254-2-03-Z-8.5  [hdr-th_6p-p2.54-v-f-r2-c3-s2.54]  60.83 10.26 0 top
U75  S6B-PH-K-S(LF)(SN)  [conn-th_6p-p2.00_s6b-ph-k-s-lf-sn]  51.01 3.09 0 top
U76  INA219AIDCNR  [SOT-23-8_L3.0-W1.7-P0.65-LS2.8-BR]  54.18 7.53 90 top
WP0  -  [test-point-0.5mm]  10.68 39.85 90 top

## Footprints (pads in the part's own frame, mm; a bottom-side part is the same pattern mirrored in y, then rotated)
audio-th_pj-35372
  oval 1x1.5 hole 0.6x1.1: 1(-2.4,3.55) 2(-2.4,0.55) 3(-2.4,-2.25) 4(-2.4,-4.45) 5(2.4,4.45) 6(2.4,2.55) 7(2.4,-0.45) 8(2.4,-2.55)
C0402
  rect 0.79x0.54 smd: 1(-0.545,0) 2(0.545,0)
C0603
  rect 0.8x0.9 smd: 1(-0.7,0) 2(0.7,0)
CAP-SMD_BD6.3-L6.6-W6.6-LS7.3-FD
  rect 3.5x1.2 smd: 1(-2.67,0) 2(2.67,0)
conn-th_6p-p2.00_s6b-ph-k-s-lf-sn
  round 1.5 hole 0.8: 1(-5,0) 2(-3,0) 3(-1,0) 4(1,0) 5(3,0) 6(5,0)
HDR-TH_2P-P2.54-V-M
  rect 2x2 hole 1.2: 1(-1.27,0)
  round 2 hole 1.2: 2(1.27,0)
hdr-th_5p-p2.54-v-f
  rect 1.575x1.575 hole 1.02: 1(-5.08,0)
  round 1.575 hole 1.02: 2(-2.54,0) 3(0,0) 4(2.54,0) 5(5.08,0)
hdr-th_6p-p2.54-v-f-r2-c3-s2.54
  rect 1.7x1.6 hole 1: 1(-2.54,-1.27)
  round 1.6 hole 1: 2(-2.54,1.27) 3(0,-1.27) 4(0,1.27) 5(2.54,-1.27) 6(2.54,1.27)
LED0805-R-RD
  rect 1x1.399 smd: 1(1.05,0) 2(-1.05,0)
Pad_e241
  round 3 hole 4x3: 15(0,0)
Pad_e117043
  round 0.7 hole 0.3: 41(0,0)
Pad_e117044
  round 0.7 hole 0.3: 46(0,0)
Pad_e117045
  round 0.7 hole 0.3: 45(0,0)
Pad_e117046
  round 0.7 hole 0.3: 44(0,0)
Pad_e117047
  round 0.7 hole 0.3: 43(0,0)
Pad_e117048
  round 0.7 hole 0.3: 42(0,0)
R0402
  rect 0.566x0.54 smd: 1(-0.433,0) 2(0.433,0)
R0603
  rect 0.806x0.864 smd: 1(-0.753,0) 2(0.753,0)
R2512
  rect 1.282x3.456 smd: 1(-3.067,0) 2(3.067,0)
RASBERRYPI-3-HAT-EXT
  round 1.575 hole 0.889: 1(0,-2.54) 2(0,0) 3(2.54,-2.54) 4(2.54,0) 5(5.08,-2.54) 6(5.08,0) 7(7.62,-2.54) 8(7.62,0) 9(10.16,-2.54) 10(10.16,0) 11(12.7,-2.54) 12(12.7,0) 13(15.24,-2.54) 14(15.24,0) 15(17.78,-2.54) 16(17.78,0) 17(20.32,-2.54) 18(20.32,0) 19(22.86,-2.54) 20(22.86,0) 21(25.4,-2.54) 22(25.4,0) 23(27.94,-2.54) 24(27.94,0) 25(30.48,-2.54) 26(30.48,0) 27(33.02,-2.54) 28(33.02,0) 29(35.56,-2.54) 30(35.56,0) 31(38.1,-2.54) 32(38.1,0) 33(40.64,-2.54) 34(40.64,0) 35(43.18,-2.54) 36(43.18,0) 37(45.72,-2.54) 38(45.72,0) 39(48.26,-2.54) 40(48.26,0)
  round 0.7 hole 0.3: 41(-4.877,0.889) 41(-4.877,-48.133) 41(53.035,0.889) 41(53.035,-48.133) 42(-6.724,-0.178) 42(-6.724,-49.2) 42(51.188,-0.178) 42(51.188,-49.2) 43(-6.724,-2.312) 43(-6.724,-51.334) 43(51.188,-2.312) 43(51.188,-51.334) 44(-4.877,-3.378) 44(-4.877,-52.4) 44(53.035,-3.378) 44(53.035,-52.4) 45(-3.029,-2.312) 45(-3.029,-51.334) 45(54.883,-2.312) 45(54.883,-51.334) 46(-3.029,-0.178) 46(-3.029,-49.2) 46(54.883,-0.178) 46(54.883,-49.2)
rj45-th_r-rj45r08p-b000
  round 1.524 hole 0.914: 1(3.57,-0.89) 2(2.55,0.89) 3(1.53,-0.89) 4(0.51,0.89) 5(-0.51,-0.89) 6(-1.53,0.89) 7(-2.55,-0.89) 8(-3.57,0.89)
  round 2.5 hole 1.8: 9(-8.13,0.13) 10(8.13,0.13)
SOIC-8_L5.0-W4.0-P1.27-LS6.0-BL
  oval 0.569x1.95 smd: 1(-1.905,-2.705) 2(-0.635,-2.705) 3(0.635,-2.705) 4(1.905,-2.705) 5(1.905,2.705) 6(0.635,2.705) 7(-0.635,2.705) 8(-1.905,2.705)
SOT-23-8_L3.0-W1.7-P0.65-LS2.8-BR
  oval 1.252x0.364 smd: 1(1.226,-0.975) 2(1.226,-0.325) 3(1.226,0.325) 4(1.226,0.975) 5(-1.226,0.975) 6(-1.226,0.325) 7(-1.226,-0.325) 8(-1.226,-0.975)
SW-SMD_DSHP03TS-S
  oval 0.56x2.655 smd: 1(-1.27,-3.803) 2(0,-3.803) 3(1.27,-3.803) 4(1.27,3.803) 5(0,3.803) 6(-1.27,3.803)
teensy4.0
  round 1.524 hole 0.914: 0(0,-2.54) 1(0,-5.08) 2(0,-7.62) 3(0,-10.16) 4(0,-12.7) 5(0,-15.24) 6(0,-17.78) 7(0,-20.32) 8(0,-22.86) 9(0,-25.4) 10(0,-27.94) 11(0,-30.48) 12(0,-33.02) 13(15.24,-33.02) 14(15.24,-30.48) 15(15.24,-27.94) 16(15.24,-25.4) 17(15.24,-22.86) 18(15.24,-20.32) 19(15.24,-17.78) 20(15.24,-15.24) 21(15.24,-12.7) 22(15.24,-10.16) 23(15.24,-7.62) 24(15.24,-5.08) 25(2.54,-33.02) 26(5.08,-33.02) 27(7.62,-33.02) 28(10.16,-33.02) 29(12.7,-33.02) G1(0,0) G2(15.24,-2.54) Vin(15.24,0)
test-point-0.5mm
  round 1 smd: 1(0,0)
tmc5160
  rect 2x2 hole 1.2: 1(0,0)
  round 2 hole 1.2: 2(0,-2.54) 3(0,-5.08) 4(0,-7.62) 5(0,-10.16) 6(0,-12.7) 7(0,-15.24) 8(0,-17.78) 9(12.7,-17.78) 10(12.7,-15.24) 11(12.7,-12.7) 12(12.7,-10.16) 13(12.7,-7.62) 14(12.7,-5.08) 15(12.7,-2.54) 16(12.7,0)

## Nets
As in the schematic, except:
GND: C1.2 C2.2 C3.2 C4.2 C5.2 C6.2 C7.2 C8.2 C9.1 C10.2 C11.2 C12.2 C13.1 CN1.1 CN1.5 CN2.1 CN2.5 DRV1/RA.9 DRV1/RA.15 DRV2/DEC.9 DRV2/DEC.15 DRV3/FOC.1 DRV3/FOC.9 DRV3/FOC.15 DRV4/ROT.1 DRV4/ROT.9 DRV4/ROT.15 GN0.1 GPS.4 NOREF.44 NOREF#2.45 NOREF#3.46 NOREF#4.42 NOREF#5.41 NOREF#6.15 NOREF#7.43 RJ1.9 RJ1.10 RJ2.9 RJ2.10 RJ3.9 RJ3.10 RJ4.9 RJ4.10 TN1.G1 TN1.G2 U0.6 U0.9 U0.14 U0.20 U0.25 U0.30 U0.34 U0.39 U0.41 U0.42 U0.43 U0.44 U0.45 U0.46 U17.4 U55.1 U55.3 U55.5 U75.5 U76.3 U76.7 U76.8

Pads without a net: CN1 2 6; CN2 2 6; TN1 25 26 27 28 29; U0 32; U17 1 2

## Via types
v1: diameter 0.61, hole 0.305, Top Layer to Bottom Layer, 59 vias

## Routing (per net, layer and track width the routed paths; a pad name or vN(x,y) marks a point on that pad's centre or on a via; arc(x,y) is an arc through that point)
+3.3V: length 200.5
  Top Layer w0.3: R5.2 14.23,45.81 U17.8 ; v1(51.9,8.93) 51.9,8.21 C10.1 52.53,8.08 U76.4 ; U17.8 13.44,45.91 11,43.47 8.83,43.47 U17.3 ; U17.8 14.14,47.37 C9.2 14.12,47.69 13,48.81 9.6,48.81 8.33,50.08 U0.1
  Top Layer w0.5: 20.09,27.85 20.09,30.01 ; 20.09,30.01 17.61,30.01 ; 20.09,30.01 20.09,32.17 ; R10.2 55.83,17.57 DRV2/DEC.10 ; R10.2 R9.2 ; R10.2 R11.2 ; R7.2 R6.2 ; R7.2 55.83,35.22 55.2,34.58 ; R7.2 R8.2 ; R16.2 R17.2 ; R16.2 R15.2 ; R16.2 1.73,30.01
  Inner1 w0.5: 55.2,34.58 50.88,38.9 39.58,38.9 37.04,41.44 31.58,41.44 28.65,44.36 ; 19.64,35.35 9.6,35.35 8.33,36.62 ; 19.64,35.35 GPS.5 28.65,44.36 ; 19.64,35.35 21.29,33.7 21.29,31.79 19.51,30.01 ; 1.73,30.01 8.33,36.62 ; 8.33,36.62 U0.1 ; 28.65,44.36 U0.17 ; 19.51,30.01 17.61,30.01 ; 19.51,30.01 21.16,28.36 21.16,14.77 25.43,10.5 51.9,10.5 ; v1(51.9,8.93) 51.9,10.5 ; 51.9,10.5 51.9,10.84 55.2,14.14 DRV2/DEC.10
+5V_PI: length 86.7
  Inner2 w0.5: TN1.Vin 46.81,47.79 45.16,49.44 45.16,51.86 44.53,52.49 12.14,52.49 U0.4 U0.2
  Bottom Layer w0.5: TN1.Vin 46.05,45.25 46.05,16.93 44.78,15.66 44.78,13.76 47.45,11.09 H4.2
+12V: length 130.1
  Top Layer w0.3: 51.26,11.47 51.64,11.85 52.15,11.85 54.51,9.5 U76.2
  Top Layer w1: C2.1 70.38,22.84 C6.1 70.38,16.99 DRV2/DEC.16 ; 70.44,34.58 70.38,34.65 C5.1 70.38,40.49 C1.1 ; C3.1 23.51,14.83 C7.1 17.67,14.83 DRV3/FOC.16 ; C4.1 7.64,14.83 C8.1 1.79,14.83 DRV4/ROT.16
  Top Layer w2: 1.73,14.65 1.73,13.38 3.71,11.4 17.98,11.4 ; 70.44,34.58 71.33,34.58 73.1,32.81 73.1,18.08 71.96,16.93 DRV2/DEC.16 70.44,15.92 68.91,14.39 53.8,14.39 51.26,11.85 51.26,11.47 49.46,11.47 R28.1 49.28,11.4 17.98,11.4 ; 17.98,11.4 17.61,11.77 DRV3/FOC.16
+12V_DI: length 10.9
  Top Layer w0.3: 55.41,11.6 55.16,11.35 U76.1
  Top Layer w2: 55.41,11.6 55.47,11.53 U55.2 U55.4 U55.6
GND:
  vias: v1(4.02,26.2) v1(4.02,23.41) v1(4.02,20.23) v1(6.68,31.16) v1(6.68,29) v1(11.26,27.35) v1(13.29,36.36) v1(15.06,36.36) v1(18.11,38.01) v1(19.89,26.2) v1(19.89,23.54) v1(19.89,20.23) v1(22.41,31.09) v1(22.41,28.93) v1(27.13,27.35) v1(27.38,48.56) v1(29.92,48.56) v1(36.02,36.62) v1(36.78,29) v1(37.16,13.63) v1(37.54,38.9) v1(38.81,30.9) v1(40.85,22.54) v1(40.85,19.73) v1(41.26,25.06) v1(41.35,8.93) v1(50.5,22.77) v1(50.5,19.85) v1(50.83,43.82) v1(51.9,31.66) v1(54.69,39.54) v1(54.94,21.89) v1(56.72,39.54) v1(56.72,25.07) v1(57.23,27.22) v1(57.74,44.87) v1(58.63,32.05) v1(59.01,23.02) v1(59.13,39.54) v1(61.67,38.9) v1(61.67,21.25) v1(64.47,37.78) v1(64.47,19.22) v1(69.93,7.28) v1(71.58,13.76) v1(79.35,7.25)
+3.3T: length 125.3
  Top Layer w0.3: R31.2 76.41,52.06 v1(76.41,50.71) ; R32.2 74.68,7.59 v1(74.25,7.15) ; R24.1 R25.1 R26.1 37.43,16.68 R27.1 ; CN1.4 73.33,11.31 R30.1
  Top Layer w0.5: v1(46.94,19.73) 46.94,19.34 44.66,17.07 R27.1
  Inner1 w0.3: v1(76.41,50.71) 75.14,49.44 75.14,44.49 73.36,42.71 ; 73.36,42.71 75.14,40.94 75.14,8.04 v1(74.25,7.15) ; 73.36,42.71 TN1.24
  Inner1 w0.5: CN1.4 69.33,10.21 CN1.8
  Bottom Layer w0.5: TN1.24 46.94,41.06 v1(46.94,19.73) ; CN1.4 73.47,10.21 74.25,9.44 v1(74.25,7.15)
AUX0: length 57.2
  Top Layer w0.3: LED1.2 v1(82.16,51.73)
  Inner2 w0.3: v1(82.16,51.73) 66.88,51.73 64.72,49.57 51.9,49.57 48.85,46.52 46.94,46.52 45.55,45.13 45.55,33.06 TN1.19
AUX3: length 75.5
  Top Layer w0.3: C11.1 83.61,8.01 CN2.3 ; R29.1 75.19,8.75 75.9,8.04 75.9,7.25 CN2.7
  Inner1 w0.5: CN2.7 79.93,6.21 CN2.3
  Inner2 w0.3: TN1.4 42.24,26.2 42.24,14.27 43.51,13 71.83,13 75.9,8.93 75.9,7.25 CN2.7
AUX4: length 76.7
  Top Layer w0.3: LED2.2 76.03,3.05 76.03,4.1 76.79,4.87 77.55,4.87 78.31,5.63 78.31,6.94 CN2.8 ; C13.2 81.78,10.26 CN2.4
  Inner1 w0.3: TN1.22 45.67,37.63 v1(44.15,36.11)
  Inner1 w0.5: CN2.8 78.83,10.21 CN2.4
  Inner2 w0.3: CN2.8 76.93,10.18 72.47,14.65 51.01,14.65 49.74,15.92 49.74,16.04 48.09,16.04 44.15,19.98 v1(44.15,36.11)
DE+: length 23.6
  Top Layer w0.3: R26.2 35.28,16.7 TN1.12
  Bottom Layer w0.3: TN1.12 33.35,13.76 38.94,8.17 43.26,8.17 48.01,3.42 U75.2
DE-: length 27
  Top Layer w0.3: TN1.11 33.78,17.31 34.87,18.4 R25.2
  Bottom Layer w0.3: TN1.11 34.62,16.04 34.62,14.35 39.28,9.69 42.62,9.69 47.83,4.49 49.35,4.49 50.01,3.84 U75.3
DRV1_1A: length 26.9
  Bottom Layer w0.8: 60.28,34.58 60.28,40.68 61.42,41.83 78.44,41.83 79.46,42.85 80.22,42.85
DRV1_1B: length 31.5
  Bottom Layer w0.8: 80.22,44.89 79.34,44.89 78.32,43.87 58.89,43.87 57.74,42.71 57.74,34.58
DRV1_2A: length 22.4
  Bottom Layer w0.8: 62.82,34.58 62.82,38.65 63.95,39.79 78.69,39.79 79.71,40.81 80.22,40.81
DRV1_2B: length 17.9
  Bottom Layer w0.8: 80.22,38.77 79.57,38.77 78.55,37.75 66.36,37.75 65.36,36.74 65.36,34.58
DRV1_DIR: length 20
  Top Layer w0.3: SWPI1.3 48.09,34.58 TN1.21
  Inner2 w0.3: TN1.21 47.32,36.36 47.32,43.47 47.83,43.98 49.36,43.98 52.66,47.28
DRV1_EN: length 53.7
  Inner2 w0.3: 70.44,47.28 75.64,42.08 75.64,26.71 72.72,23.79 55.83,23.79 49.35,17.31 TN1.14
DRV1_M0: length 60.2
  Top Layer w0.3: 67.9,47.28 67.52,47.28 61.93,41.7 SWM1.1
  Inner2 w0.3: TN1.15 48.97,19.85 55.45,26.33 72.98,26.33 74.25,27.6 74.25,40.93 67.9,47.28
DRV1_M1: length 55.1
  Top Layer w0.3: SWM1.2 62.18,42.97 65.36,46.14 65.36,47.28
  Inner2 w0.3: 65.36,47.28 72.85,39.79 72.85,28.87 72.09,28.11 54.31,28.11 TN1.16
DRV1_M2: length 35.9
  Top Layer w0.3: SWM1.3 62.44,44.24 63.71,45.51 63.71,46.4 62.82,47.28
  Inner2 w0.3: TN1.17 50.88,27.22 50.88,39.54 54.56,43.22 58.75,43.22 62.82,47.28
DRV1_SR: length 33.6
  Top Layer w0.3: TN1.18 48.21,27.85 46.05,27.85 44.65,29.26 SWPI1.1
  Top Layer w0.5: 57.74,47.28 60.28,47.28
  Inner2 w0.3: 57.74,47.28 50.37,39.92 50.37,29.25 TN1.18
DRV1_STP: length 22
  Top Layer w0.3: SWPI1.2 47.83,33.31 TN1.20
  Inner2 w0.3: 55.2,47.28 55.2,45.76 49.86,40.43 49.86,33.31 49.1,32.55 TN1.20
DRV2_1A: length 25.9
  Bottom Layer w0.8: DRV2/DEC.12 60.28,22.01 61.42,23.16 79.2,23.16 80.22,24.18
DRV2_1B: length 30.5
  Bottom Layer w0.8: DRV2/DEC.11 57.74,24.04 58.89,25.2 79.2,25.2 80.22,26.22
DRV2_2A: length 21.3
  Bottom Layer w0.8: 80.22,22.14 79.2,21.12 63.95,21.12 62.82,19.98 DRV2/DEC.13
DRV2_2B: length 17
  Bottom Layer w0.8: 80.22,20.1 79.2,19.08 66.1,19.08 65.36,18.33 DRV2/DEC.14
DRV2_DIR: length 37.1
  Top Layer w0.3: DRV2/DEC.8 49.36,26.33 SWPI2.3
  Top Layer w0.5: DRV2/DEC.8 52.91,29.38
  Inner1 w0.3: TN1.2 32.08,38.9 32.08,36.87 32.59,36.36 34.75,36.36 39.83,31.28 51.01,31.28 DRV2/DEC.8
DRV2_DIR_PI: length 23.5
  Top Layer w0.3: SWPI2.4 38.18,26.33 40.47,28.62 40.47,45.94 41.76,47.23
DRV2_EN: length 44
  Inner1 w0.3: DRV2/DEC.1 70.44,28.36 60.66,18.58 37.16,18.58 TN1.9
DRV2_M0: length 48.8
  Top Layer w0.3: DRV2/DEC.2 67.64,29.63 61.93,23.92 SWM2.1
  Inner1 w0.3: DRV2/DEC.2 59.39,21.12 37.16,21.12 TN1.8
DRV2_M1: length 42.8
  Top Layer w0.3: DRV2/DEC.3 65.36,28.49 62.06,25.19 SWM2.2
  Inner1 w0.3: TN1.7 37.16,23.66 59.39,23.66 DRV2/DEC.3
DRV2_M2: length 37.6
  Top Layer w0.3: SWM2.3 62.31,26.46 63.58,27.73 63.58,28.87 DRV2/DEC.4
  Inner1 w0.3: DRV2/DEC.4 59.39,26.2 37.8,26.2 33.99,30.01 TN1.6
DRV2_SR: length 49.6
  Top Layer w0.3: TN1.5 35,30.9 35,23.54 35.77,22.77 38.56,22.77 39.58,23.79 SWPI2.1
  Top Layer w0.5: DRV2/DEC.6 DRV2/DEC.5
  Inner1 w0.3: TN1.5 34.62,32.55 38.43,28.74 49.61,28.74 50.37,27.98 56.09,27.98 DRV2/DEC.6
DRV2_SR_PI: length 27.5
  Top Layer w0.3: 45.16,47.23 41.99,44.06 41.99,27.6 38.18,23.79 SWPI2.6
DRV2_STP: length 39.9
  Top Layer w0.3: DRV2/DEC.7 53.67,28.11 52.15,28.11 49.86,25.82 49.86,24.3 49.23,23.66 48.09,23.66 47.33,24.42 47.33,25.06 46.81,25.57 46.18,25.57 45.67,25.06 45.16,25.06
  Inner1 w0.3: DRV2/DEC.7 51.01,33.82 40.59,33.82 36.78,37.63 TN1.3
DRV2_STP_PI: length 25.5
  Top Layer w0.3: 43.46,47.23 41.23,45 41.23,28.11 38.18,25.06 SWPI2.5
DRV3_1A: length 32.1
  Bottom Layer w0.8: 17.61,24.93 20.65,24.93 25.1,20.49 25.1,13.25 27.13,11.22 30.94,11.22 RJ3.4 36.66,5.5 RJ3.3
DRV3_1B: length 35.7
  Bottom Layer w0.8: DRV3/FOC.11 21.92,27.47 27.64,21.76 27.64,13.63 28.78,12.49 31.71,12.49 RJ3.2 38.7,5.5 RJ3.1
DRV3_2A: length 28.6
  Bottom Layer w0.8: DRV3/FOC.13 19.51,22.39 22.56,19.34 22.56,12.74 25.48,9.82 30.3,9.82 RJ3.6 34.62,5.5 RJ3.5
DRV3_2B: length 25.4
  Bottom Layer w0.8: RJ3.7 32.58,5.5 RJ3.8 29.53,8.55 23.57,8.55 20.27,11.85 20.27,18.2 18.62,19.85 DRV3/FOC.14
DRV3_DIR: length 19
  Bottom Layer w0.5: DRV3/FOC.8 31.19,33.44 U0.19
DRV3_M0: length 44.4
  Top Layer w0.3: SWM3.1 24.59,23.41 30.31,17.69 DRV3/FOC.2
  Top Layer w0.5: SWPI3.3 v1(42.88,42.84)
  Bottom Layer w0.3: DRV3/FOC.2 31.96,18.96 31.96,20.11 32.97,21.12 34.5,21.12 39.83,26.46 39.83,33.95 44.53,38.65 44.53,41.19 v1(42.88,42.84)
DRV3_M1: length 37.3
  Top Layer w0.3: DRV3/FOC.3 30.31,19.86 30.19,19.98 29.16,19.98 25.86,23.28 SWM3.2
  Top Layer w0.5: v1(42.88,41.57) SWPI3.2
  Bottom Layer w0.3: v1(42.88,41.57) 43.77,40.68 43.77,39.92 37.8,33.95 37.8,27.35 34.12,23.66 32.84,23.66 31.96,22.77 31.96,21.5 DRV3/FOC.3
DRV3_M2: length 31.5
  Top Layer w0.3: SWM3.3 27.13,23.16 28.53,21.76 29.67,21.76 DRV3/FOC.4
  Top Layer w0.5: SWPI3.1 v1(42.88,40.3)
  Bottom Layer w0.3: v1(42.88,40.3) 42.12,40.3 35.77,33.95 35.77,28.11 33.86,26.2 32.59,26.2 31.96,25.57 31.96,24.04 DRV3/FOC.4
DRV3_SR: length 31.6
  Top Layer w0.5: DRV3/FOC.6 30.31,24.93
  Bottom Layer w0.5: U0.16 27.38,52.49 27.38,50.33 26.11,49.06 26.11,31.66 DRV3/FOC.6
DRV3_STP: length 25.5
  Bottom Layer w0.5: 30.31,30.01 28.65,31.66 28.65,48.94 29.92,50.21 29.92,52.49 U0.18
DRV4_1A: length 29
  Bottom Layer w0.8: RJ4.3 17.48,5.5 RJ4.4 11.77,11.22 10.87,11.22 9.35,12.74 9.35,20.36 4.78,24.93 1.73,24.93
DRV4_1B: length 32.4
  Bottom Layer w0.8: DRV4/ROT.11 5.67,27.47 11.76,21.38 11.76,13.26 RJ4.2 19.52,5.5 RJ4.1
DRV4_2A: length 26
  Bottom Layer w0.8: RJ4.5 15.44,5.5 RJ4.6 11,9.95 8.21,9.95 6.94,11.22 6.94,18.96 3.51,22.39 DRV4/ROT.13
DRV4_2B: length 22.7
  Bottom Layer w0.8: DRV4/ROT.14 2.62,19.85 4.52,17.95 4.52,10.58 6.56,8.55 10.35,8.55 RJ4.8 13.4,5.5 RJ4.7
DRV4_DIR: length 23.6
  Bottom Layer w0.5: DRV4/ROT.8 14.18,32.81 14.18,42.46 21.16,49.44 22.69,49.44 23.57,50.33 U0.13
DRV4_M0: length 9.6
  Top Layer w0.3: DRV4/ROT.2 14.43,17.74 8.72,23.45 SWM4.1
DRV4_M1: length 7.1
  Top Layer w0.3: DRV4/ROT.3 13.42,19.85 9.98,23.29 SWM4.2
DRV4_M2: length 5.3
  Top Layer w0.3: SWM4.3 11.26,23.28 12.78,21.76 13.8,21.76 DRV4/ROT.4
DRV4_SR: length 31.1
  Top Layer w0.5: 14.43,24.93 DRV4/ROT.6
  Bottom Layer w0.5: U0.11 20.53,51.22 12.27,42.97 12.27,29.63 DRV4/ROT.6
DRV4_STP: length 27.4
  Bottom Layer w0.5: 14.43,30.01 15.95,31.54 15.95,41.82 20.91,46.78 23.19,46.78 25.23,48.81 25.23,49.57 26.11,50.46 U0.15
DRV31_M0/DIR_PI: length 15.4
  Top Layer w0.3: SWPI1.4 37.29,34.83 37.29,36.74 34.75,39.28 34.75,41.44 36.15,42.84 SWPI3.4 37.04,46.84 36.66,47.23
DRV31_M1/STP_PI: length 20.5
  Top Layer w0.3: 38.36,47.23 38.31,47.18 38.31,45.25 39.07,44.49 39.07,42.12 38.52,41.57 SWPI3.5 35.64,41.57 35.26,41.19 35.26,39.54 38.69,36.11 38.69,33.48 38.52,33.31 SWPI1.5
DRV31_M2/SR_PI: length 19.9
  Top Layer w0.3: 39.19,40.3 39.19,39.28 39.7,38.78 39.7,33.23 38.52,32.05 SWPI1.6 ; 39.19,40.3 SWPI3.6 ; 39.19,40.3 39.19,41.32 39.7,41.82 39.7,46.88 40.06,47.23
ID_SC: length 38.2
  Top Layer w0.3: U17.6 14.92,43.37 15.45,42.84 17.99,42.84 v1(19,41.82)
  Inner1 w0.3: v1(19,41.82) 19.76,42.59 19.76,51.73 20.53,52.49 40.08,52.49 U0.28
ID_SD: length 46.5
  Top Layer w0.3: v1(17.99,41.82) 15.45,41.82 15.17,42.1 U17.5
  Inner1 w0.3: v1(17.99,41.82) 17.22,42.59 17.22,54.27 18.03,55.08 42.07,55.08 42.62,54.52 42.62,52.49 U0.27
PEC: length 64.5
  Top Layer w0.3: CN1.7 67.42,6.2 C12.1
  Inner1 w0.3: TN1.23 49.35,40.94 68.53,40.94 74.25,35.22 74.25,8.8 73.46,8.01 CN1.3
  Inner1 w0.5: CN1.7 70.43,6.21 CN1.3
PPS: length 16.2
  Top Layer w0.5: U0.22 33.73,53.64 32.58,52.48 22.8,52.48 22.3,51.98 22.3,48.17 GPS.1
RA+: length 33.5
  Top Layer w0.3: TN1.13 46.69,16.68 R27.2
  Bottom Layer w0.3: TN1.13 57.99,5.38 57.99,2.2 56.85,1.06 47.07,1.06 46.01,2.12 U75.1
RA-: length 29.8
  Top Layer w0.3: R24.2 35.65,19.85 TN1.10
  Bottom Layer w0.3: U75.4 52.01,3.51 50.27,5.25 47.96,5.25 39.7,13.5 39.7,15.66 35.51,19.85 TN1.10
RX_ONSTEP: length 10.9
  Top Layer w0.5: U0.24 35.77,53.76 35,53 35,50.21 35.38,49.83 35.38,46.27 34.37,45.25 TN1.0
RXD: length 12.5
  Top Layer w0.5: U0.10 18.49,53.64 19.76,52.36 19.76,45.13 21.92,42.97 GPS.3
SCL: length 74.5
  Top Layer w0.3: v1(53.04,5.25) 53.21,5.42 U76.5
  Inner2 w0.3: U0.5 13.41,44.49 25.61,32.3 25.61,13.88 29.29,10.2 42.37,10.2 46.56,6.01 52.28,6.01 v1(53.04,5.25)
SDA: length 79.2
  Top Layer w0.3: U76.6 53.86,5.32 v1(53.93,5.25)
  Inner2 w0.3: v1(53.93,5.25) 53.93,4.74 53.55,4.36 52.66,4.36 51.64,5.38 46.18,5.38 43.51,8.04 28.4,8.04 23.45,13 23.45,31.03 10.87,43.6 U0.3
TX_ONSTEP: length 11.2
  Top Layer w0.5: TN1.1 32.59,42.71 31.19,44.11 31.19,49.19 33.23,51.22 U0.21
TXD: length 20.6
  Top Layer w0.5: U0.8 17.22,52.49 17.22,46.14 21.66,41.7 23.2,41.7 23.7,42.2 23.7,43.6 22.18,45.13 GPS.2
$2N62787: length 8.5
  Top Layer w0.3: R5.1 15.52,44.64 U17.7 13.31,44.64 11.38,42.71 11.38,40.56 WP0.1
$2N104513: length 13.1
  Inner2 w0.5: U75.6 57.36,3.09 57.86,3.59 57.86,5.88 55.83,7.92 H4.1
$2N105510: length 3.3
  Top Layer w0.5: R18.1 36.27,48.48 U0.23
$2N105512: length 6.7
  Top Layer w0.5: R19.1 37.54,48.91 37.54,52.87 38.43,53.76 U0.26
$2N105514: length 8.4
  Top Layer w0.5: R20.1 40.06,48.87 40.07,48.89 40.07,51.84 40.72,52.49 41.99,52.49 43.26,51.22 U0.29
$2N105697: length 6.5
  Top Layer w0.5: R21.1 41.76,49.09 42.62,49.95 44.91,49.95 46.18,51.22 U0.31
$2N105699: length 11.1
  Top Layer w0.5: U0.35 50.88,51.22 49.62,52.48 48.33,52.48 47.7,51.86 47.7,50.59 46.31,49.19 44.55,49.19 R22.1
$2N105701: length 12.4
  Top Layer w0.5: R23.1 46.61,48.1 48.47,49.95 52.15,49.95 52.78,50.59 52.78,52.49 U0.36
$2N106392: length 3.1
  Top Layer w0.3: LED1.1 79.62,53.69 77.17,53.69
$2N106431: length 3.2
  Top Layer w0.3: LED2.1 75.14,4.27 R32.1
$2N106601: length 1.7
  Top Layer w0.3: 75.2,11.31 75.2,11.15 74.37,10.33 74.37,10 R29.2
$9N9567: length 3.5
  Top Layer w0.3: SWM4.6 6.57,32.16 6.56,32.17 5.21,32.17
$9N9568: length 9.7
  Top Layer w0.3: 5.21,27.85 10.11,27.85 11.26,29 SWM4.4
$9N9569: length 6.8
  Top Layer w0.3: 5.21,30.01 9.74,30.01 9.98,30.26 SWM4.5
$9N9693: length 9.7
  Top Layer w0.3: SWM3.4 27.13,29.12 25.86,27.85 R14.1
$9N9694: length 3.6
  Top Layer w0.3: SWM3.6 24.59,32.17 R12.1
$9N9695: length 6.7
  Top Layer w0.3: R13.1 25.23,30.01 25.86,30.65 SWM3.5
$9N9819: length 10.2
  Top Layer w0.3: R11.1 58.12,25.19 56.85,26.46 SWM2.4
$9N9820: length 3.9
  Top Layer w0.3: R9.1 53.55,23.91 SWM2.6
$9N9821: length 7.1
  Top Layer w0.3: R10.1 55.83,24.68 55.32,25.19 SWM2.5
$9N9945: length 4.1
  Top Layer w0.3: SWM1.6 53.55,37.57 R6.1
$9N9946: length 10.5
  Top Layer w0.3: SWM1.4 56.85,44.24 58.12,42.97 R8.1
$9N9947: length 7.2
  Top Layer w0.3: SWM1.5 55.03,42.97 55.83,42.17 R7.1

## Copper pours and planes (outline as drawn; the poured copper is in the pictures)
GND on Top Layer: 0.08,55.92 85.04,55.92 85.04,0.04 0.08,0.04
GND on Bottom Layer: 0.08,55.92 85.04,55.92 85.04,0.04 0.08,0.04
GND on Inner1: 0.08,55.92 85.04,55.92 85.04,0.04 0.08,0.04
GND on Inner2: 0.08,55.92 85.04,55.92 85.04,0.04 0.08,0.04

## Text on the board
Bottom Silkscreen Layer: 12V | GND | PEC | +3.3V | AUX4 | AUX3 | B2 | B1 | A1 | A2 | JLCJLCJLCJLC | DRV4 | oshwlab.com/ / pololamag/ / astronstep | DRV3 | v1.0 | DRV1 | DRV2
Top Silkscreen Layer: PPS | TXD | RXD | GND | 3.3V | EN | DIR | DRV3[Mx] to PI | DRV1 to PI | DRV2 to PI | M0 | M2 | ST4 | +12V IN | v1.0
